# EAGLE schematic DataForge-DAQ (EAGLE 9.2.1)

## Sheet 1 of 8: Block diagram
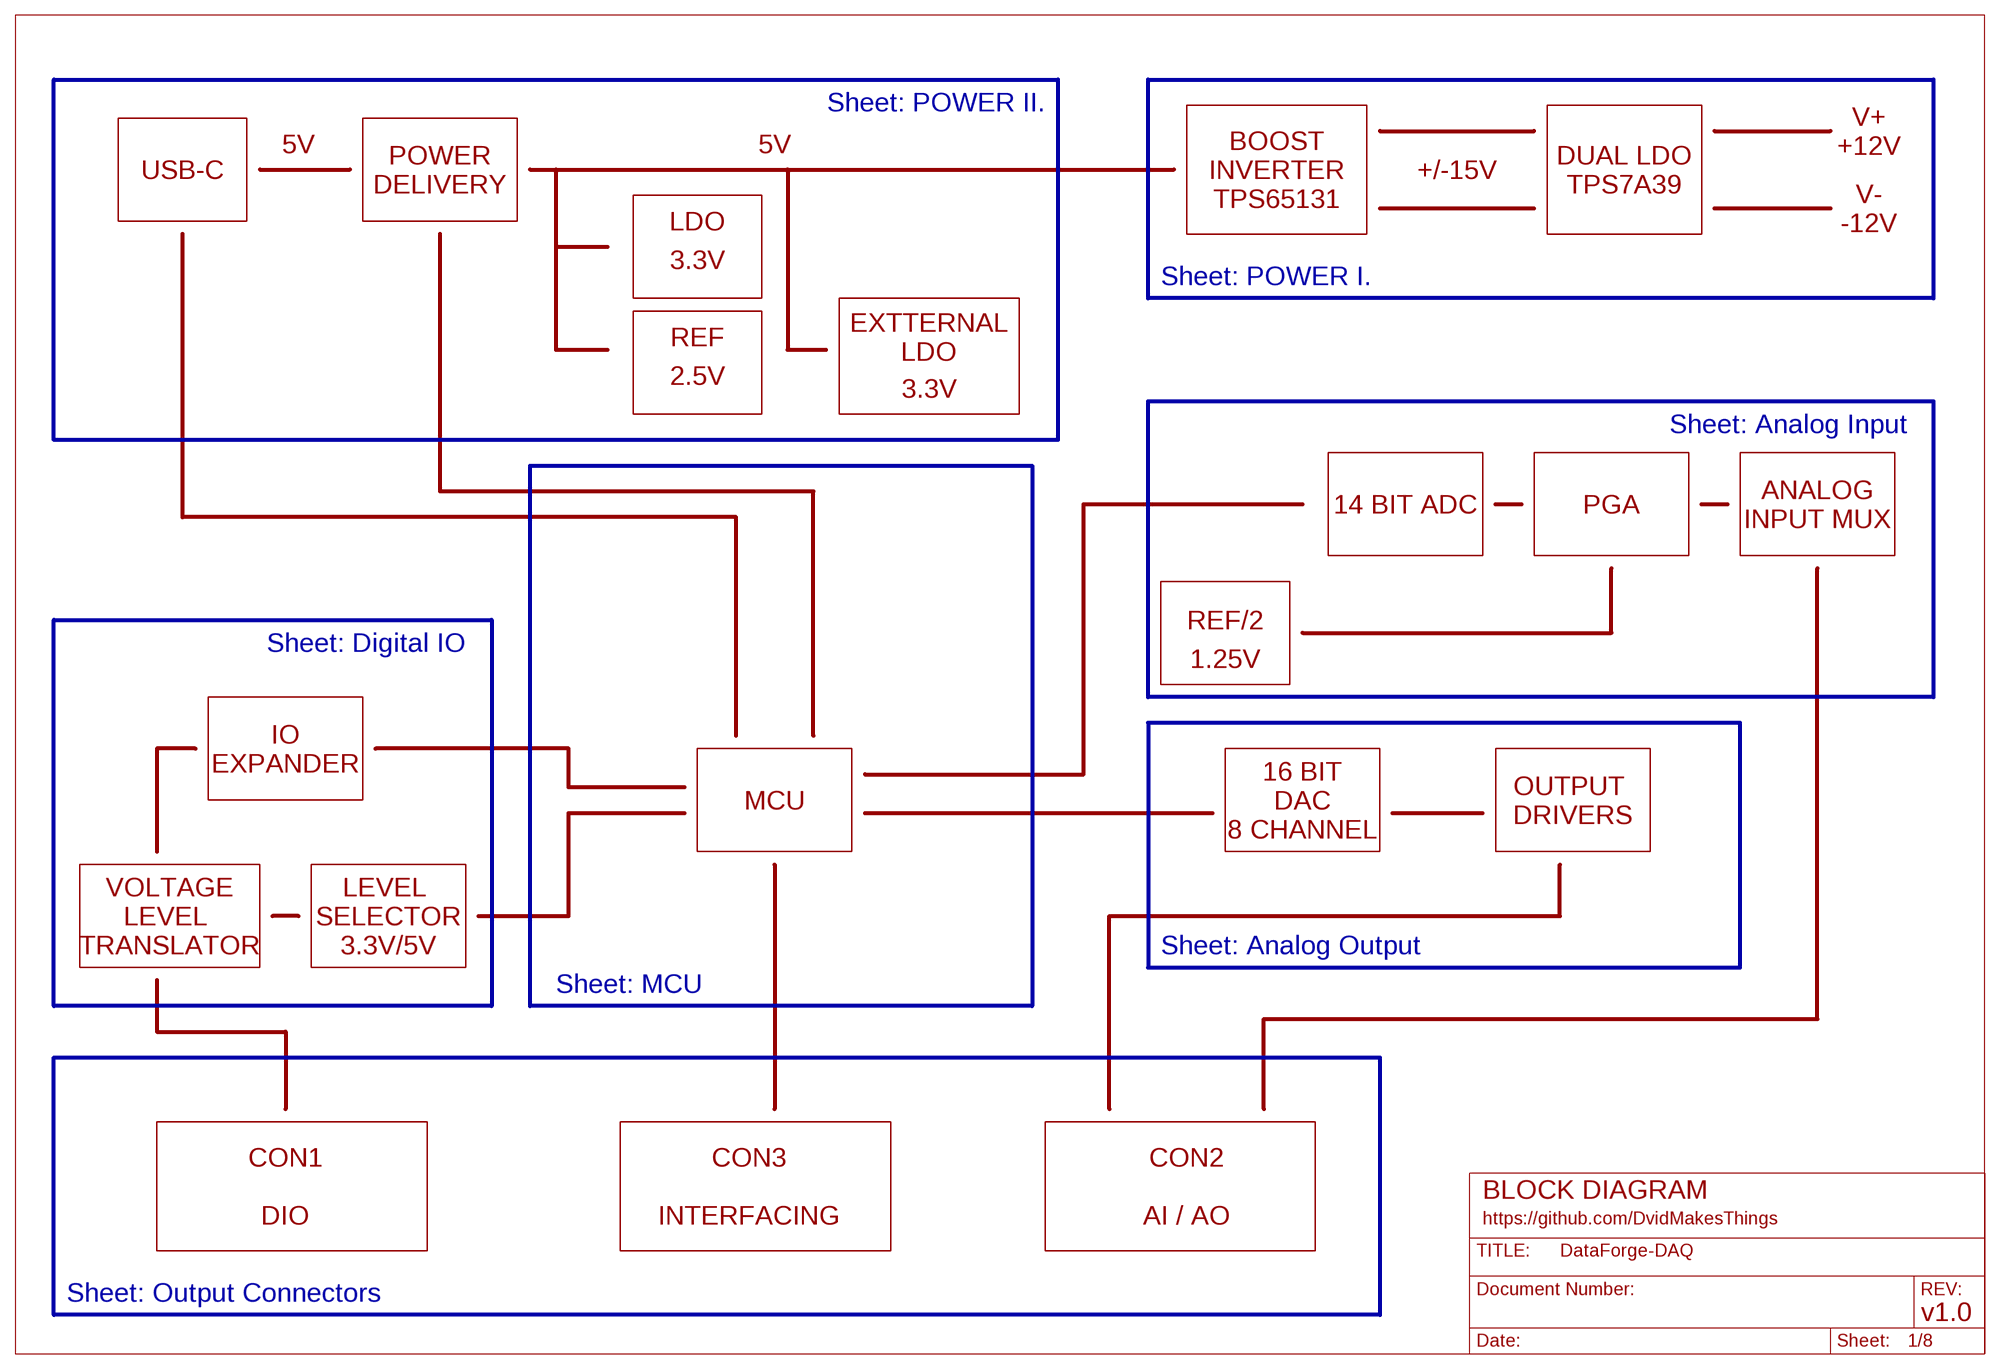
[diagram p0: schematic, sheet 1]

### Buses
B$1
B$2
B$3
B$4
B$5
B$6
B$7

### Notes on the sheet
- Sheet: POWER II.
- V+
  +12V
- 5V | 5V
- USB-C
- POWER
  DELIVERY
- BOOST
  INVERTER
  TPS65131
- +/-15V
- DUAL LDO
  TPS7A39
- V-
  -12V
- LDO
- 3.3V
- Sheet: POWER I.
- REF
- EXTTERNAL
  LDO
- 2.5V
- 3.3V
- Sheet: Analog Input
- 14 BIT ADC | PGA
- ANALOG
  INPUT MUX
- REF/2
- Sheet: Digital IO
- 1.25V
- IO
  EXPANDER
- MCU
- 16 BIT
  DAC
  8 CHANNEL
- OUTPUT 
  DRIVERS
- VOLTAGE
  LEVEL 
  TRANSLATOR
- LEVEL 
  SELECTOR
  3.3V/5V
- Sheet: Analog Output
- Sheet: MCU
- CON1
  
  DIO
- CON3
  
  INTERFACING
- CON2
  
  AI / AO
- BLOCK DIAGRAM
- https://github.com/DvidMakesThings
- Sheet: Output Connectors | v1.0

## Sheet 2 of 8: Power I. +/-12V
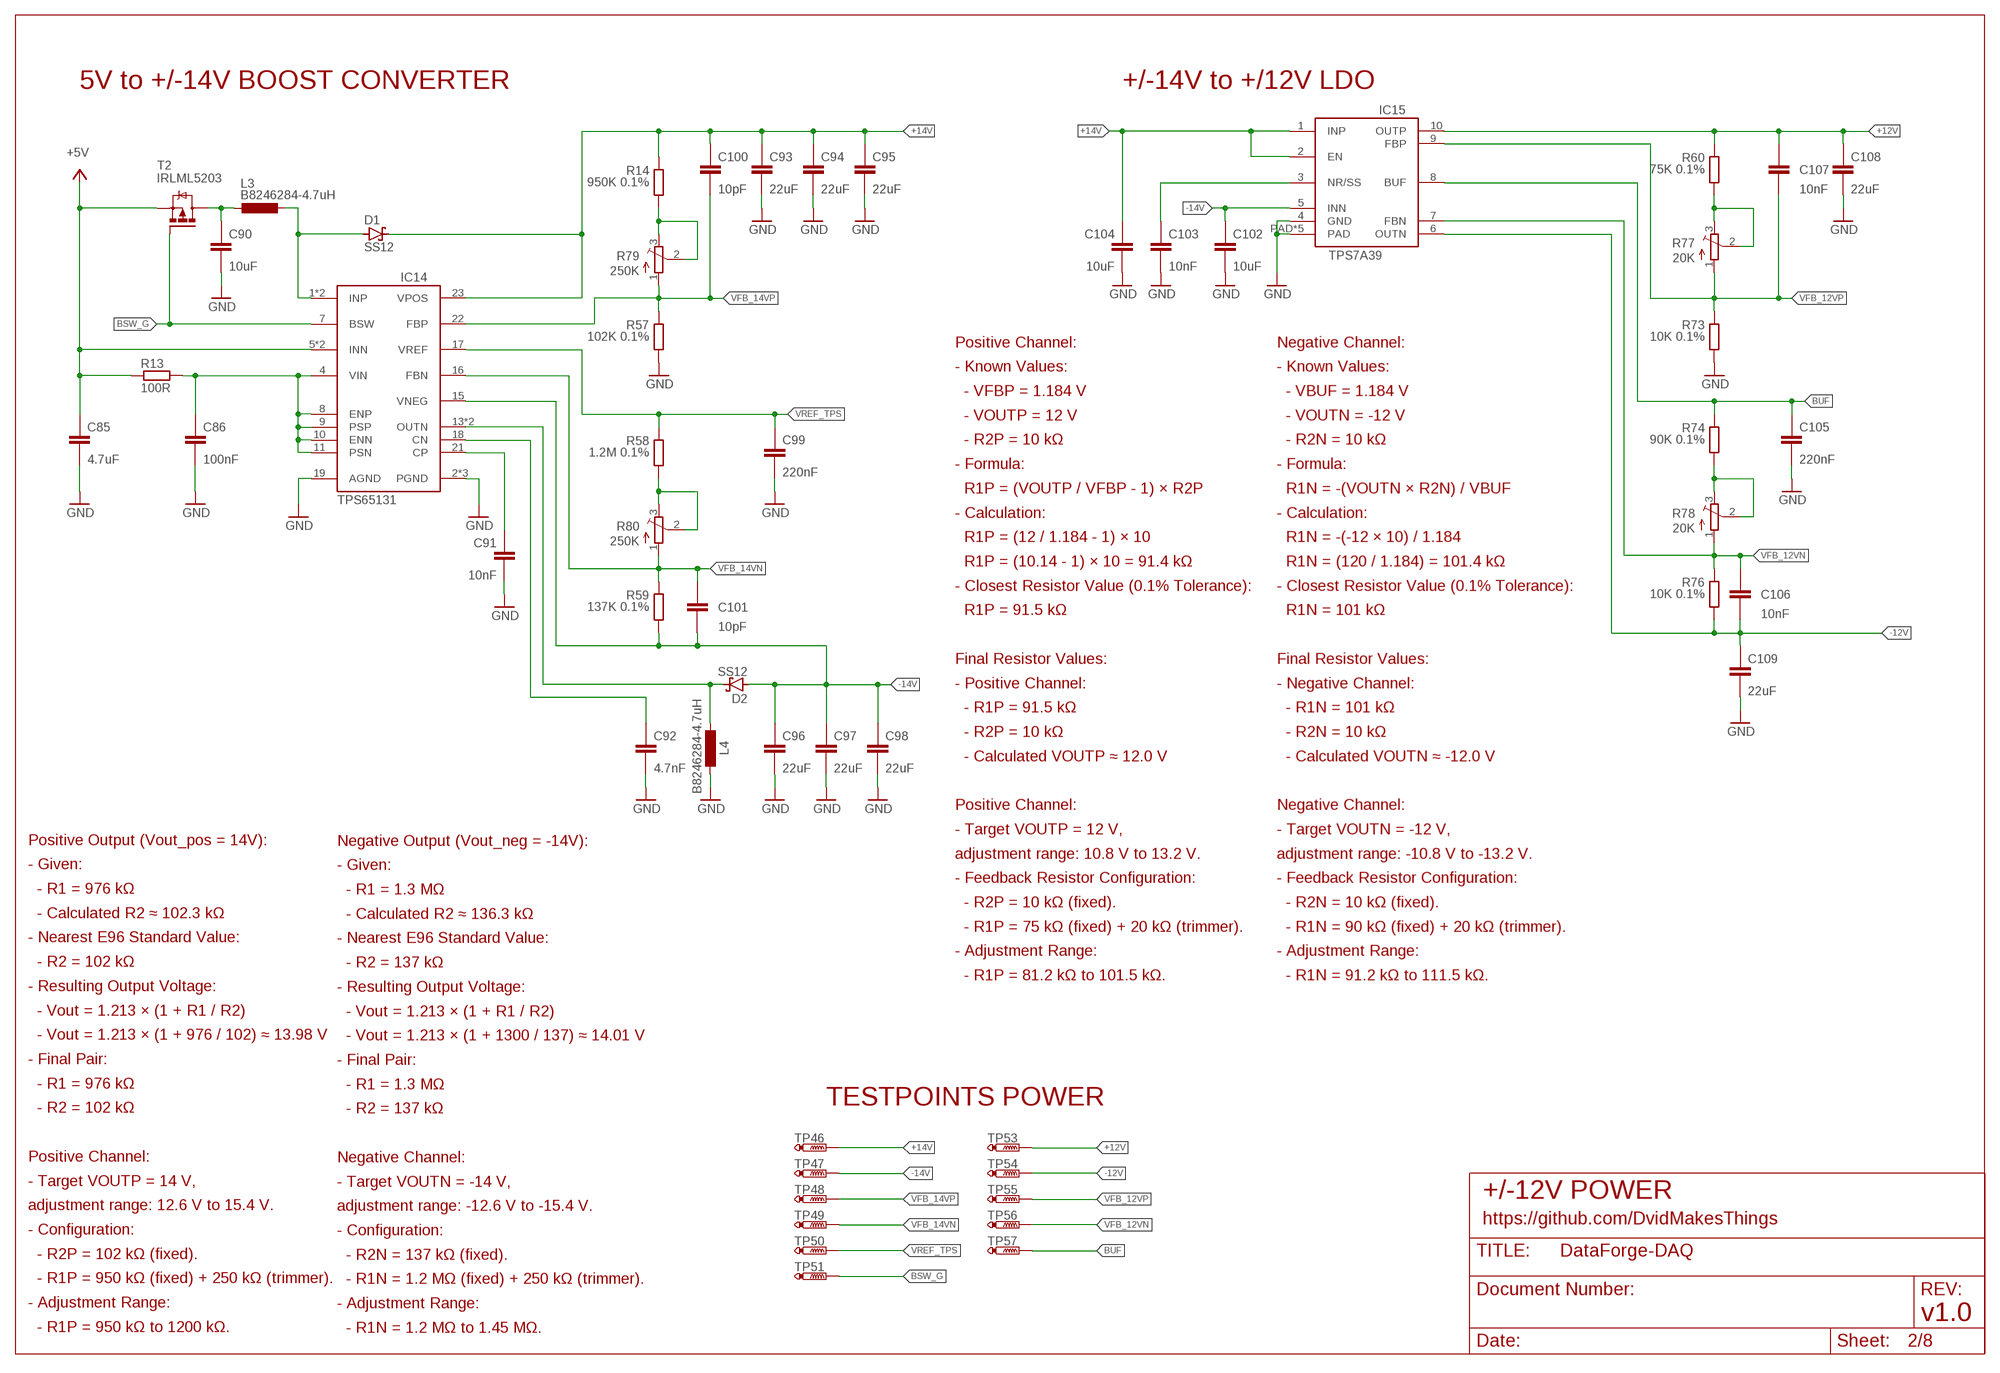
[diagram p1: schematic, sheet 2]

### Parts
C85  4.7uF  C0805  [0805]
C86  100nF  C0805  [0805]
C90  10uF  C0805  [0805]
C91  10nF  C0805  [0805]
C92  4.7nF  C0805  [0805]
C93  22uF  C1206  [1206]
C94  22uF  C1206  [1206]
C95  22uF  C1206  [1206]
C96  22uF  C1206  [1206]
C97  22uF  C1206  [1206]
C98  22uF  C1206  [1206]
C99  220nF  C0402  [0402]
C100  10pF  C0402  [0402]
C101  10pF  C0402  [0402]
C102  10uF  C1206  [1206]
C103  10nF  C1206  [1206]
C104  10uF  C1206  [1206]
C105  220nF  C0402  [0402]
C106  10nF  C0402  [0402]
C107  10nF  C0402  [0402]
C108  22uF  C1206  [1206]
C109  22uF  C1206  [1206]
D1  SS12  [SMA]
D2  SS12  [SMA]
IC14  TPS65131  TPS65131TRGERQ1  [VQFN24-4X4-THERMAL2.5X2.5]
IC15  TPS7A39  TPS7A3901DSCR  [WSON10-3X3]
L3  B8246284-4.7uH  MSS7341  [MSS7341]
L4  B8246284-4.7uH  MSS7341  [MSS7341]
R13  100R  R1206  [1206]
R14  950K 0.1%  R0402  [0402]
R57  102K 0.1%  R0402  [0402]
R58  1.2M 0.1%  R0402  [0402]
R59  137K 0.1%  R0402  [0402]
R60  75K 0.1%  R0402  [0402]
R73  10K 0.1%  R0402  [0402]
R74  90K 0.1%  R0402  [0402]
R76  10K 0.1%  R0402  [0402]
R77  20K  TRIM_EU-3223G  [3223G]
R78  20K  TRIM_EU-3223G  [3223G]
R79  250K  TRIM_EU-3223G  [3223G]
R80  250K  TRIM_EU-3223G  [3223G]
T2  IRLML5203  [MICRO3]
TP46  PTR1B1,27  [B1,27]
TP47  PTR1B1,27  [B1,27]
TP48  PTR1B1,27  [B1,27]
TP49  PTR1B1,27  [B1,27]
TP50  PTR1B1,27  [B1,27]
TP51  PTR1B1,27  [B1,27]
TP53  PTR1B1,27  [B1,27]
TP54  PTR1B1,27  [B1,27]
TP55  PTR1B1,27  [B1,27]
TP56  PTR1B1,27  [B1,27]
TP57  PTR1B1,27  [B1,27]

### Nets
+5V: C85.1 IC14.5(INN) IC14.6(INN) R13.2 T2.2(S) ; also sheet 3,7
+12V: C107.2 C108.1 IC15.10(OUTP) R60.1 TP53.TP
+14V: C93.1 C94.1 C95.1 C100.1 C104.1 D1.C IC14.23(VPOS) IC15.1(INP) IC15.2(EN) R14.1 TP46.TP
-12V: C106.1 C109.1 IC15.6(OUTN) R76.2 TP54.TP
-14V: C96.1 C97.1 C98.1 C101.1 C102.1 D2.A IC14.15(VNEG) IC15.5(INN) R59.2 TP47.TP
BSW_G: IC14.7(BSW) T2.1(G) TP51.TP
BUF: C105.2 IC15.8(BUF) R74.1 TP57.TP
GND: C85.2 C86.2 C90.2 C91.2 C92.2 C93.2 C94.2 C95.2 C96.2 C97.2 C98.2 C99.1 C102.2 C103.2 C104.2 C105.1 C108.2 C109.2 IC14.2(PGND) IC14.3(PGND) IC14.19(AGND) IC14.25(PGND) IC15.4(GND) IC15.PAD IC15.PAD1(PAD) IC15.PAD2(PAD) IC15.PAD3(PAD) IC15.PAD4(PAD) L4.1 R57.2 R73.2 ; also sheet 3,4,5,6,7,8
N$13: D1.A IC14.1(INP) IC14.24(INP) L3.2
N$24: C90.1 L3.1 T2.3(D)
N$30: C86.1 IC14.4(VIN) IC14.8(ENP) IC14.9(PSP) IC14.10(ENN) IC14.11(PSN) R13.1
N$32: C91.1 IC14.21(CP)
N$35: C92.1 IC14.18(CN)
N$36: D2.C IC14.13(OUTN) IC14.14(OUTN) L4.2
N$38: R60.2 R77.2(S) R77.3(E)
N$39: C103.1 IC15.3(NR/SS)
N$42: R74.2 R78.2(S) R78.3(E)
N$43: R14.2 R79.2(S) R79.3(E)
N$44: R58.2 R80.2(S) R80.3(E)
VFB_12VN: C106.2 IC15.7(FBN) R76.1 R78.1(A) TP56.TP
VFB_12VP: C107.1 IC15.9(FBP) R73.1 R77.1(A) TP55.TP
VFB_14VN: C101.2 IC14.16(FBN) R59.1 R80.1(A) TP49.TP
VFB_14VP: C100.2 IC14.22(FBP) R57.1 R79.1(A) TP48.TP
VREF_TPS: C99.2 IC14.17(VREF) R58.1 TP50.TP

### Notes on the sheet
- 5V to +/-14V BOOST CONVERTER | +/-14V to +/12V LDO
- Positive Channel:
  - Known Values:
    - VFBP = 1.184 V
    - VOUTP = 12 V
    - R2P = 10 kΩ
  - Formula:
    R1P = (VOUTP / VFBP - 1) × R2P
  - Calculation:
    R1P = (12 / 1.184 - 1) × 10
    R1P = (10.14 - 1) × 10 = 91.4 kΩ
  - Closest Resistor Value (0.1% Tolerance):
    R1P = 91.5 kΩ
  
  Final Resistor Values:
  - Positive Channel:
    - R1P = 91.5 kΩ
    - R2P = 10 kΩ
    - Calculated VOUTP ≈ 12.0 V
  
  Positive Channel:
  - Target VOUTP = 12 V, 
  adjustment range: 10.8 V to 13.2 V.
  - Feedback Resistor Configuration:
    - R2P = 10 kΩ (fixed).
    - R1P = 75 kΩ (fixed) + 20 kΩ (trimmer).
  - Adjustment Range:
    - R1P = 81.2 kΩ to 101.5 kΩ.
- Negative Channel:
  - Known Values:
    - VBUF = 1.184 V
    - VOUTN = -12 V
    - R2N = 10 kΩ
  - Formula:
    R1N = -(VOUTN × R2N) / VBUF
  - Calculation:
    R1N = -(-12 × 10) / 1.184
    R1N = (120 / 1.184) = 101.4 kΩ
  - Closest Resistor Value (0.1% Tolerance):
    R1N = 101 kΩ
  
  Final Resistor Values:
  - Negative Channel:
    - R1N = 101 kΩ
    - R2N = 10 kΩ
    - Calculated VOUTN ≈ -12.0 V
  
  Negative Channel:
  - Target VOUTN = -12 V, 
  adjustment range: -10.8 V to -13.2 V.
  - Feedback Resistor Configuration:
    - R2N = 10 kΩ (fixed).
    - R1N = 90 kΩ (fixed) + 20 kΩ (trimmer).
  - Adjustment Range:
    - R1N = 91.2 kΩ to 111.5 kΩ.
- Positive Output (Vout_pos = 14V):
  - Given:
    - R1 = 976 kΩ
    - Calculated R2 ≈ 102.3 kΩ
  - Nearest E96 Standard Value:
    - R2 = 102 kΩ
  - Resulting Output Voltage:
    - Vout = 1.213 × (1 + R1 / R2)
    - Vout = 1.213 × (1 + 976 / 102) ≈ 13.98 V
  - Final Pair:
    - R1 = 976 kΩ
    - R2 = 102 kΩ
  
  Positive Channel:
  - Target VOUTP = 14 V, 
  adjustment range: 12.6 V to 15.4 V.
  - Configuration:
    - R2P = 102 kΩ (fixed).
    - R1P = 950 kΩ (fixed) + 250 kΩ (trimmer).
  - Adjustment Range:
    - R1P = 950 kΩ to 1200 kΩ.
- Negative Output (Vout_neg = -14V):
  - Given:
    - R1 = 1.3 MΩ
    - Calculated R2 ≈ 136.3 kΩ
  - Nearest E96 Standard Value:
    - R2 = 137 kΩ
  - Resulting Output Voltage:
    - Vout = 1.213 × (1 + R1 / R2)
    - Vout = 1.213 × (1 + 1300 / 137) ≈ 14.01 V
  - Final Pair:
    - R1 = 1.3 MΩ
    - R2 = 137 kΩ
  
  Negative Channel:
  - Target VOUTN = -14 V, 
  adjustment range: -12.6 V to -15.4 V.
  - Configuration:
    - R2N = 137 kΩ (fixed).
    - R1N = 1.2 MΩ (fixed) + 250 kΩ (trimmer).
  - Adjustment Range:
    - R1N = 1.2 MΩ to 1.45 MΩ.
- TESTPOINTS POWER
- +/-12V POWER
- https://github.com/DvidMakesThings
- v1.0

## Sheet 3 of 8: Power II. USB-C PD
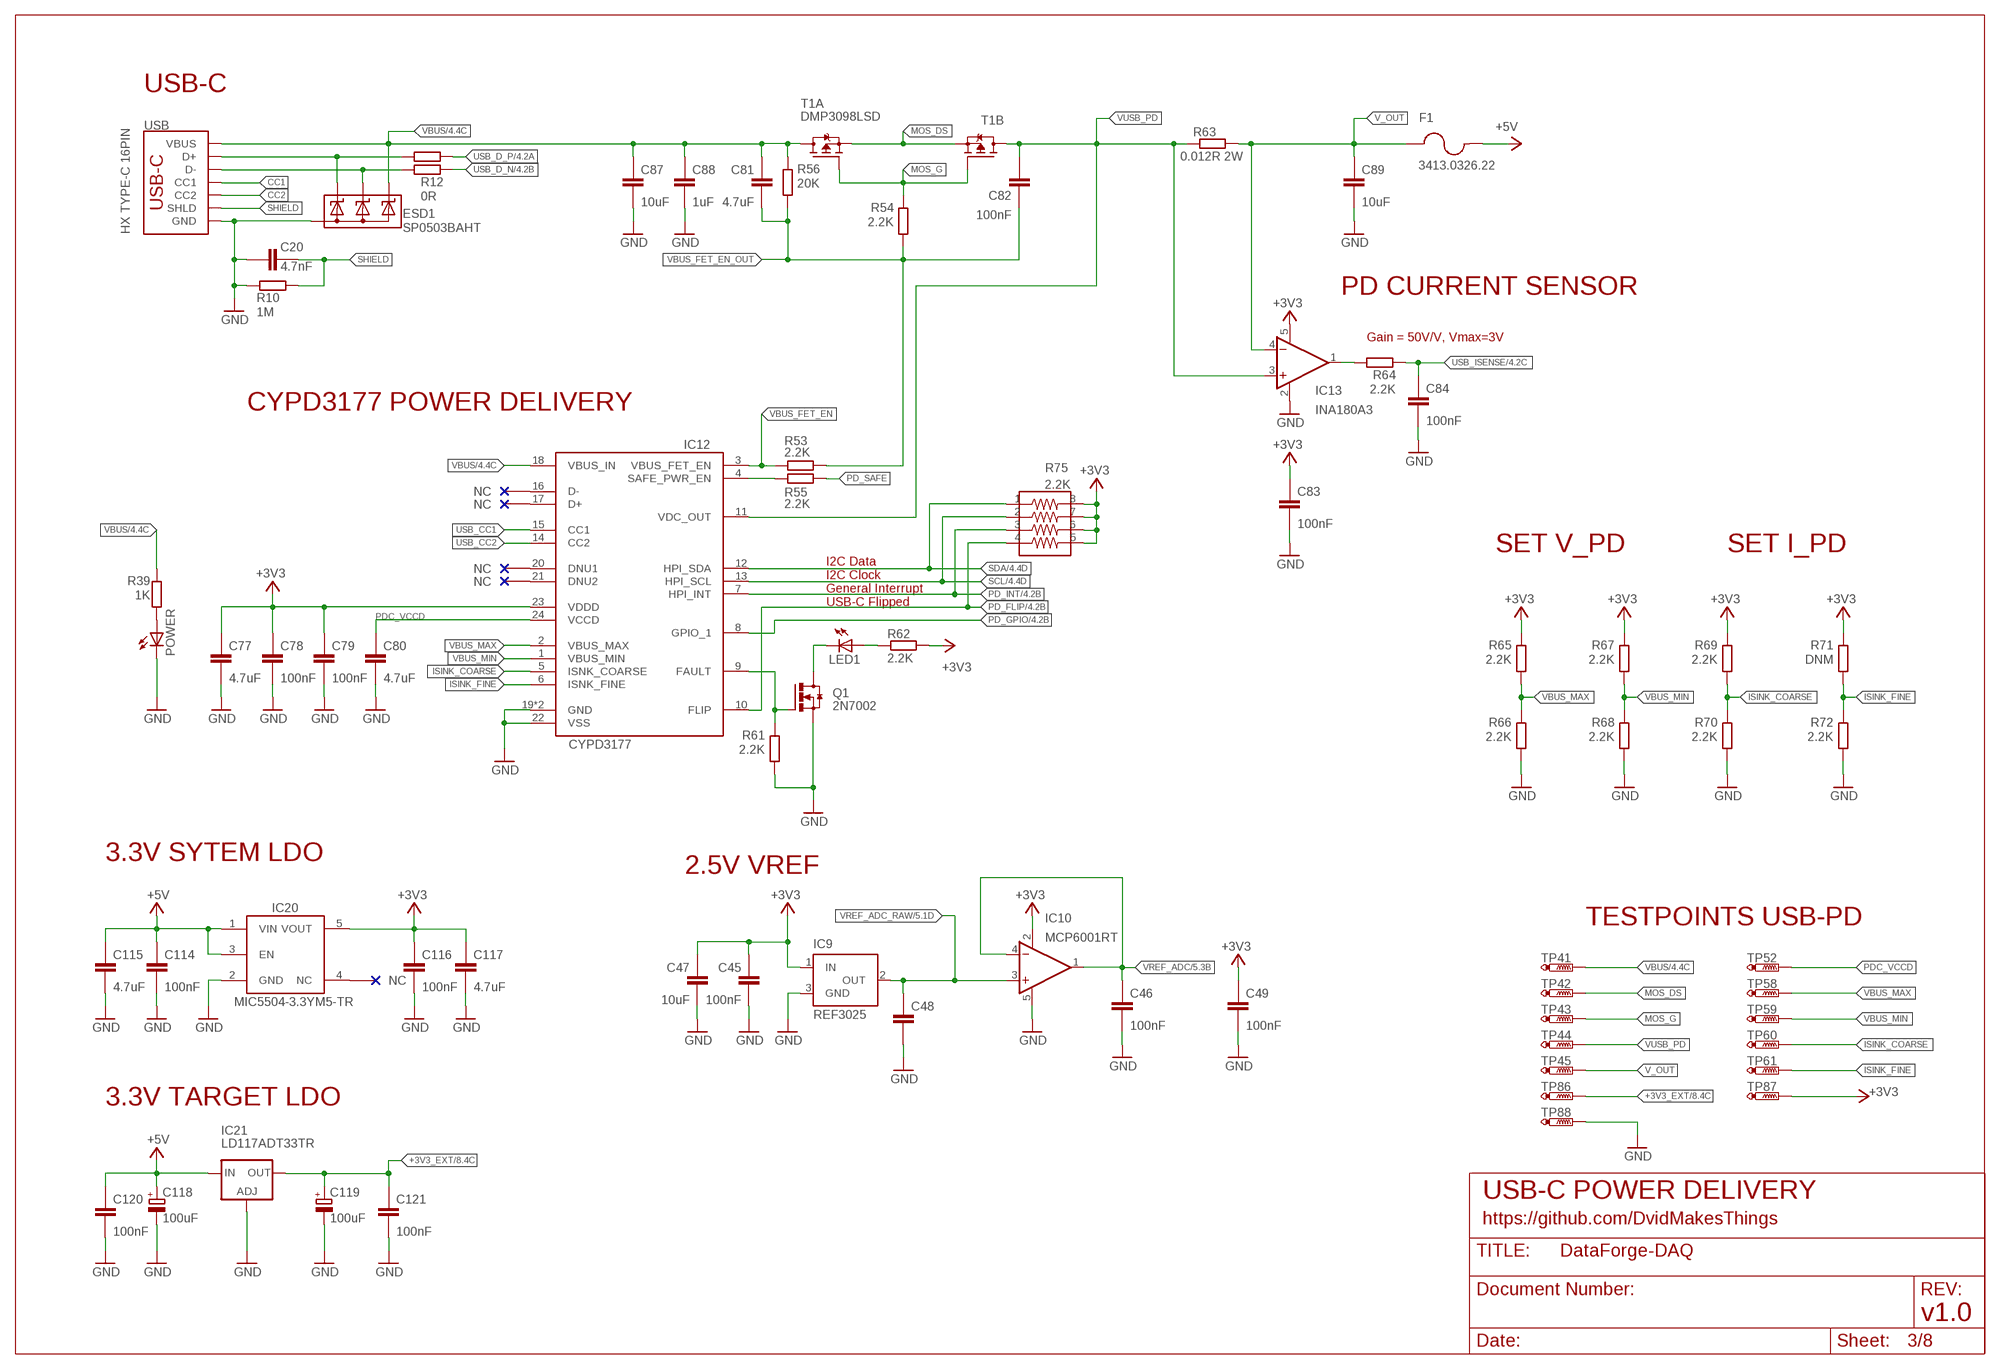
[diagram p2: schematic, sheet 3]

### Parts
C20  4.7nF  C0402  [0402]
C45  100nF  C0402  [0402]
C46  100nF  C0402  [0402]
C47  10uF  C0805  [0805]
C48  C0805  [0805]
C49  100nF  C0402  [0402]
C77  4.7uF  C0603  [0603]
C78  100nF  C0402  [0402]
C79  100nF  C0402  [0402]
C80  4.7uF  C0603  [0603]
C81  4.7uF  C0603  [0603]
C82  100nF  C0402  [0402]
C83  100nF  C0402  [0402]
C84  100nF  C0402  [0402]
C87  10uF  C1206  [1206]
C88  1uF  C1206  [1206]
C89  10uF  C1206  [1206]
C114  100nF  C0402  [0402]
C115  4.7uF  C0603  [0603]
C116  100nF  C0402  [0402]
C117  4.7uF  C0603  [0603]
C118  100uF  CPOL-EU153CLV-0605  [153CLV-0605]
C119  100uF  CPOL-EU153CLV-0605  [153CLV-0605]
C120  100nF  C0402  [0402]
C121  100nF  C0402  [0402]
ESD1  SP0503BAHT  [SOT143]
F1  3413.0326.22  [3413.0326.22]
IC9  REF3025  MAX6520  [SOT23]
IC10  MCP6001RT  [SOT23-5]
IC12  CYPD3177  CYPD3177-24LQXQ  [QFN50P400X400X60-25T275N]
IC13  INA180A3  INA180A3-IDBVR  [SOT23-5]
IC20  MIC5504-3.3YM5-TR  [SOT23-5]
IC21  LD117ADT33TR  [DPACK]
LED1  LEDCHIP-LED0805  [CHIP-LED0805]
POWER  19-213/Y2C-CQ2R2L/3T(CY)  LEDCHIP-LED0603  [CHIP-LED0603]
Q1  2N7002  2N7002,215  [SOT23-3]
R10  1M  R0402  [0402]
R11  0R  R-EU_R0402  [R0402]
R12  0R  R-EU_R0402  [R0402]
R39  1K  R-EU_R0402  [R0402]
R53  2.2K  R0402  [0402]
R54  2.2K  R0402  [0402]
R55  2.2K  R0402  [0402]
R56  20K  R0402  [0402]
R61  2.2K  R0402  [0402]
R62  2.2K  R0402  [0402]
R63  0.012R 2W  R-EU_R2512  [R2512]
R64  2.2K  R0402  [0402]
R65  2.2K  R0402  [0402]
R66  2.2K  R0402  [0402]
R67  2.2K  R0402  [0402]
R68  2.2K  R0402  [0402]
R69  2.2K  R0402  [0402]
R70  2.2K  R0402  [0402]
R71  DNM  R0402  [0402]
R72  2.2K  R0402  [0402]
R75  2.2K  742C083103JP  [742C083103JP]
T1  DMP3098LSD  DMP3098-LSD-13  [SO8]
TP41  PTR1B1,27  [B1,27]
TP42  PTR1B1,27  [B1,27]
TP43  PTR1B1,27  [B1,27]
TP44  PTR1B1,27  [B1,27]
TP45  PTR1B1,27  [B1,27]
TP52  PTR1B1,27  [B1,27]
TP58  PTR1B1,27  [B1,27]
TP59  PTR1B1,27  [B1,27]
TP60  PTR1B1,27  [B1,27]
TP61  PTR1B1,27  [B1,27]
TP86  PTR1B1,27  [B1,27]
TP87  PTR1B1,27  [B1,27]
TP88  PTR1B1,27  [B1,27]
USB  HX TYPE-C 16PIN  USB_C_2-LAYER_PADS  [USB-C-16P-2LAYER-PADS]

### Nets
+3V3: C45.1 C47.1 C49.1 C77.1 C78.1 C79.1 C83.1 C116.1 C117.1 IC9.1(IN) IC10.2(V+) IC12.23(VDDD) IC13.5(V+) IC20.5(VOUT) R62.1 R65.2 R67.2 R69.2 R71.2 R75.5 R75.6 R75.7 R75.8 TP87.TP ; also sheet 4,5,6,7
+3V3_EXT: C119.+ C121.1 IC21.4(OUT) TP86.TP ; also sheet 8
+5V: C114.1 C115.1 C118.+ C120.1 F1.2 IC20.1(VIN) IC20.3(EN) IC21.3(IN) ; also sheet 2,7
CC1: USB.A5(CC1)
CC2: USB.B5(CC2)
D_N1 [DIFFPAIR]: ESD1.3(C2) R12.2 USB.A7(D-) USB.B7(D-)
D_P1 [DIFFPAIR]: ESD1.2(C1) R11.2 USB.A6(D+) USB.B6(D+)
GND: C20.2 C45.2 C46.2 C47.2 C48.2 C49.2 C77.2 C78.2 C79.2 C80.2 C83.2 C84.2 C87.2 C88.2 C89.2 C114.2 C115.2 C116.2 C117.2 C118.- C119.- C120.2 C121.2 ESD1.1(A) IC9.3(GND) IC10.5(V-) IC12.19(GND) IC12.22(VSS) IC12.25(GND) IC13.2(V-) IC20.2(GND) IC21.1(ADJ) POWER.C Q1.2(S) R10.1 R61.1 R66.1 R68.1 R70.1 R72.1 TP88.TP USB.GND USB.GND2(GND) ; also sheet 2,4,5,6,7,8
ISINK_COARSE: IC12.5(ISNK_COARSE) R69.1 R70.2 TP60.TP
ISINK_FINE: IC12.6(ISNK_FINE) R71.1 R72.2 TP61.TP
MOS_DS [DIFFPAIR]: T1.1(A:S) T1.3(B:S) TP42.TP
MOS_G: R54.2 T1.2(A:G) T1.4(B:G) TP43.TP
N$12: IC12.4(SAFE_PWR_EN) R55.1
N$18: IC12.9(FAULT) Q1.1(G) R61.2
N$19: LED1.A R62.2
N$20: LED1.C Q1.3(D)
N$21: IC13.1(OUT) R64.2
N$37: POWER.A R39.2
PD_FLIP: IC12.10(FLIP) R75.4 ; also sheet 4
PD_GPIO: IC12.8(GPIO_1) ; also sheet 4
PD_INT: IC12.7(HPI_INT) R75.3 ; also sheet 4
PD_SAFE: R55.2
PDC_VCCD: C80.1 IC12.24(VCCD) TP52.TP
SCL: IC12.13(HPI_SCL) R75.2 ; also sheet 4
SDA: IC12.12(HPI_SDA) R75.1 ; also sheet 4
SHIELD: C20.1 R10.2 USB.SHLD1(SHLD) USB.SHLD2(SHLD) USB.SHLD3(SHLD) USB.SHLD4(SHLD)
USB_CC1: IC12.15(CC1)
USB_CC2: IC12.14(CC2)
USB_D_N [DIFFPAIR]: R12.1 ; also sheet 4
USB_D_P [DIFFPAIR]: R11.1 ; also sheet 4
USB_ISENSE: C84.1 R64.1 ; also sheet 4
V_OUT [DIFFPAIR]: C89.1 F1.1 IC13.4(-IN) R63.2 TP45.TP
VBUS: C81.1 C87.1 C88.1 ESD1.4(C3) IC12.18(VBUS_IN) R39.1 R56.2 T1.7(A:D) T1.8(A:D) TP41.TP USB.VBUS1(VBUS) USB.VBUS2(VBUS) ; also sheet 4
VBUS_FET_EN: IC12.3(VBUS_FET_EN) R53.1
VBUS_FET_EN_OUT: C81.2 C82.2 R53.2 R54.1 R56.1
VBUS_MAX: IC12.2(VBUS_MAX) R65.1 R66.2 TP58.TP
VBUS_MIN: IC12.1(VBUS_MIN) R67.1 R68.2 TP59.TP
VREF_ADC: C46.1 IC10.1(OUT) IC10.4(-IN) ; also sheet 5
VREF_ADC_RAW: C48.1 IC9.2(OUT) IC10.3(+IN) ; also sheet 5
VUSB_PD [DIFFPAIR]: C82.1 IC12.11(VDC_OUT) IC13.3(+IN) R63.1 T1.5(B:D) T1.6(B:D) TP44.TP
Unconnected: IC12.16(D-) IC12.17(D+) IC12.20(DNU1) IC12.21(DNU2) IC20.4(NC)

### Notes on the sheet
- USB-C
- PD CURRENT SENSOR
- Gain = 50V/V, Vmax=3V
- CYPD3177 POWER DELIVERY
- SET V_PD | SET I_PD
- I2C Data
  I2C Clock
  General Interrupt
  USB-C Flipped
- 3.3V SYTEM LDO
- 2.5V VREF
- TESTPOINTS USB-PD
- 3.3V TARGET LDO
- USB-C POWER DELIVERY
- https://github.com/DvidMakesThings
- v1.0

## Sheet 4 of 8: MCU
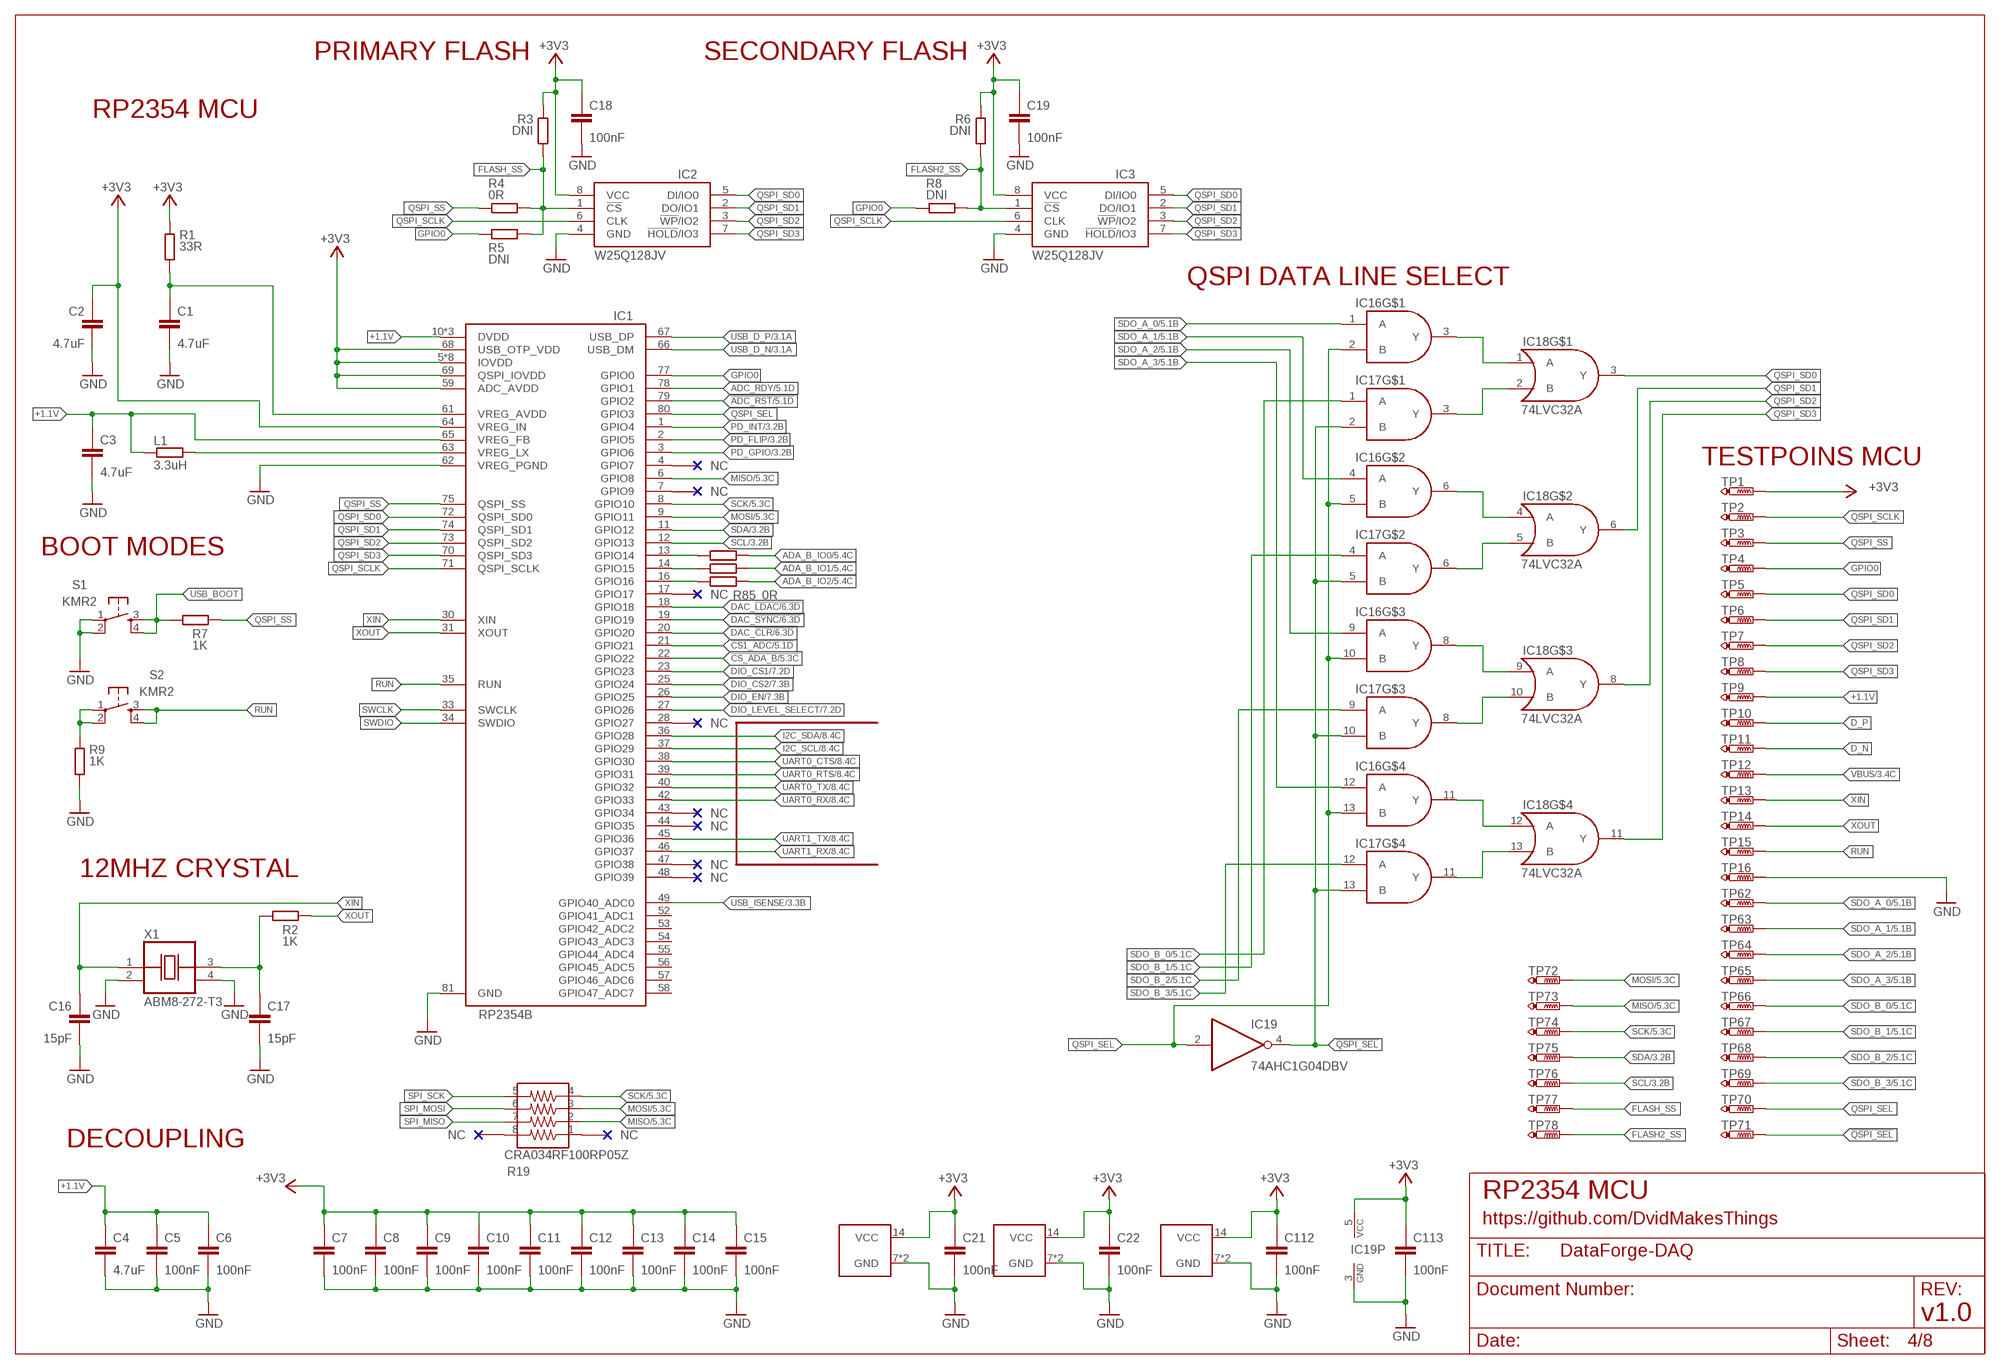
[diagram p3: schematic, sheet 4]

### Parts
C1  4.7uF  C0402  [0402]
C2  4.7uF  C0402  [0402]
C3  4.7uF  C0402  [0402]
C4  4.7uF  C0402  [0402]
C5  100nF  C0402  [0402]
C6  100nF  C0402  [0402]
C7  100nF  C0402  [0402]
C8  100nF  C0402  [0402]
C9  100nF  C0402  [0402]
C10  100nF  C0402  [0402]
C11  100nF  C0402  [0402]
C12  100nF  C0402  [0402]
C13  100nF  C0402  [0402]
C14  100nF  C0402  [0402]
C15  100nF  C0402  [0402]
C16  15pF  C0402  [0402]
C17  15pF  C0402  [0402]
C18  100nF  C0402  [0402]
C19  100nF  C0402  [0402]
C21  100nF  C0402  [0402]
C22  100nF  C0402  [0402]
C112  100nF  C0402  [0402]
C113  100nF  C0402  [0402]
IC1  RP2354B  RP2350BB  [QFN40P1000X1000X85-81T340N]
IC2  W25Q128JVP  [SON127P600X500X75-8N]
IC3  W25Q128JVP  [SON127P600X500X75-8N]
IC16  74LVC08A  [QFN50P250X300X100-15T100X150N]
IC17  74LVC08A  [QFN50P250X300X100-15T100X150N]
IC18  74LVC32A  [QFN50P250X300X100-15T100X150N]
IC19  74AHC1G04DBV  [SOT23-5]
L1  3.3uH  R0805  [0805]
R1  33R  R0402  [0402]
R2  1K  R0402  [0402]
R3  DNI  R0402  [0402]
R4  0R  R0402  [0402]
R5  DNI  R0402  [0402]
R6  DNI  R0402  [0402]
R7  1K  R0402  [0402]
R8  DNI  R0402  [0402]
R9  1K  R0402  [0402]
R19  CRA034RF100RP05Z  YC164-JR-0733RL  [YC164-JR-0733RL]
R83  0R  R0402  [0402]
R84  0R  R0402  [0402]
R85  0R  R0402  [0402]
S1  KMR2  MOMENTARY-SWITCH-SPST-2-SMD-4.6X2.8MM  [TACTILE_SWITCH_SMD_4.6X2.8MM]
S2  KMR2  MOMENTARY-SWITCH-SPST-2-SMD-4.6X2.8MM  [TACTILE_SWITCH_SMD_4.6X2.8MM]
TP1  PTR1B1,27  [B1,27]
TP2  PTR1B1,27  [B1,27]
TP3  PTR1B1,27  [B1,27]
TP4  PTR1B1,27  [B1,27]
TP5  PTR1B1,27  [B1,27]
TP6  PTR1B1,27  [B1,27]
TP7  PTR1B1,27  [B1,27]
TP8  PTR1B1,27  [B1,27]
TP9  PTR1B1,27  [B1,27]
TP10  PTR1B1,27  [B1,27]
TP11  PTR1B1,27  [B1,27]
TP12  PTR1B1,27  [B1,27]
TP13  PTR1B1,27  [B1,27]
TP14  PTR1B1,27  [B1,27]
TP15  PTR1B1,27  [B1,27]
TP16  PTR1B1,27  [B1,27]
TP62  PTR1B1,27  [B1,27]
TP63  PTR1B1,27  [B1,27]
TP64  PTR1B1,27  [B1,27]
TP65  PTR1B1,27  [B1,27]
TP66  PTR1B1,27  [B1,27]
TP67  PTR1B1,27  [B1,27]
TP68  PTR1B1,27  [B1,27]
TP69  PTR1B1,27  [B1,27]
TP70  PTR1B1,27  [B1,27]
TP71  PTR1B1,27  [B1,27]
TP72  PTR1B1,27  [B1,27]
TP73  PTR1B1,27  [B1,27]
TP74  PTR1B1,27  [B1,27]
TP75  PTR1B1,27  [B1,27]
TP76  PTR1B1,27  [B1,27]
TP77  PTR1B1,27  [B1,27]
TP78  PTR1B1,27  [B1,27]
X1  ABM8-272-T3  CRYSTAL  [OSCCC500X320X130]

### Nets
!ADC_RST: IC1.79(GPIO2) ; also sheet 5
!CS1_ADC: IC1.21(GPIO21) ; also sheet 5
!CS_ADA_B: IC1.22(GPIO22) ; also sheet 5
!QSPI_SEL: IC17.2(B) IC17.5(B) IC17.10(B) IC17.13(B) IC19.4(O) TP71.TP
+1.1V: C3.1 C4.1 C5.1 C6.1 IC1.10(DVDD) IC1.32(DVDD) IC1.51(DVDD) IC1.65(VREG_FB) L1.1 TP9.TP
+3V3: C2.1 C7.1 C8.1 C9.1 C10.1 C11.1 C12.1 C13.1 C14.1 C15.1 C21.1 C22.1 C112.1 C113.1 IC1.5(IOVDD) IC1.15(IOVDD) IC1.24(IOVDD) IC1.29(IOVDD) IC1.41(IOVDD) IC1.50(IOVDD) IC1.59(ADC_AVDD) IC1.60(IOVDD) IC1.64(VREG_IN) IC1.68(USB_OTP_VDD) IC1.69(QSPI_IOVDD) IC1.76(IOVDD) IC16.14(VCC) IC17.14(VCC) IC18.14(VCC) IC19.5(VCC) R1.1 TP1.TP ; also sheet 3,5,6,7
ADA_B_IO0: R83.1 ; also sheet 5
ADA_B_IO1: R84.1 ; also sheet 5
ADA_B_IO2: R85.1 ; also sheet 5
ADC_RDY: IC1.78(GPIO1) ; also sheet 5
D_N [DIFFPAIR]: TP11.TP
D_P [DIFFPAIR]: TP10.TP
DAC_!CLR: IC1.20(GPIO20) ; also sheet 6
DAC_!LDAC: IC1.18(GPIO18) ; also sheet 6
DAC_!SYNC: IC1.19(GPIO19) ; also sheet 6
DIO_CS1: IC1.23(GPIO23) ; also sheet 7
DIO_CS2: IC1.25(GPIO24) ; also sheet 7
DIO_EN: IC1.26(GPIO25) ; also sheet 7
DIO_LEVEL_SELECT: IC1.27(GPIO26) ; also sheet 7
FLASH2_SS: IC3.1(!CS) R6.2 R8.2 TP78.TP
FLASH_SS: IC2.1(!CS) R3.2 R4.2 R5.2 TP77.TP
GND: C1.2 C2.2 C3.2 C4.2 C5.2 C6.2 C7.2 C8.2 C9.2 C10.2 C11.2 C12.2 C13.2 C14.2 C15.2 C16.2 C17.2 C18.2 C19.2 C21.2 C22.2 C112.2 C113.2 IC1.62(VREG_PGND) IC1.81(GND) IC2.4(GND) IC3.4(GND) IC16.7(GND) IC16.PAD(GND) IC17.7(GND) IC17.PAD(GND) IC18.7(GND) IC18.PAD(GND) IC19.3(GND) R9.2 S1.1 S1.2 TP16.TP X1.2(VSS) X1.4(VDD) ; also sheet 2,3,5,6,7,8
GPIO0: IC1.77(GPIO0) R5.1 R8.1 TP4.TP
I2C_SCL: IC1.37(GPIO29) ; also sheet 8
I2C_SDA: IC1.36(GPIO28) ; also sheet 8
MISO: IC1.6(GPIO8) R19.2 TP73.TP ; also sheet 5,7
MOSI: IC1.9(GPIO11) R19.3 TP72.TP ; also sheet 5,6,7
N$1: C1.1 IC1.61(VREG_AVDD) R1.2
N$2: IC1.63(VREG_LX) L1.2
N$4: R9.1 S2.1 S2.2
N$8: IC16.3(Y) IC18.1(A)
N$45: IC1.13(GPIO14) R83.2
N$46: IC17.3(Y) IC18.2(B)
N$47: IC16.6(Y) IC18.4(A)
N$48: IC17.6(Y) IC18.5(B)
N$49: IC16.8(Y) IC18.9(A)
N$50: IC1.14(GPIO15) R84.2
N$51: IC17.8(Y) IC18.10(B)
N$52: IC16.11(Y) IC18.12(A)
N$53: IC17.11(Y) IC18.13(B)
N$54: IC1.16(GPIO16) R85.2
PD_FLIP: IC1.2(GPIO5) ; also sheet 3
PD_GPIO: IC1.3(GPIO6) ; also sheet 3
PD_INT: IC1.1(GPIO4) ; also sheet 3
QSPI_SCLK: IC1.71(QSPI_SCLK) IC2.6(CLK) IC3.6(CLK) TP2.TP
QSPI_SD0: IC1.72(QSPI_SD0) IC2.5(DI/IO0) IC3.5(DI/IO0) IC18.3(Y) TP5.TP
QSPI_SD1: IC1.74(QSPI_SD1) IC2.2(DO/IO1) IC3.2(DO/IO1) IC18.6(Y) TP6.TP
QSPI_SD2: IC1.73(QSPI_SD2) IC2.3(!WP!/IO2) IC3.3(!WP!/IO2) IC18.8(Y) TP7.TP
QSPI_SD3: IC1.70(QSPI_SD3) IC2.7(!HOLD!/IO3) IC3.7(!HOLD!/IO3) IC18.11(Y) TP8.TP
QSPI_SEL: IC1.80(GPIO3) IC16.2(B) IC16.5(B) IC16.10(B) IC16.13(B) IC19.2(I) TP70.TP
QSPI_SS: IC1.75(QSPI_SS) R4.1 R7.2 TP3.TP
RUN: IC1.35(RUN) S2.3 S2.4 TP15.TP
SCK: IC1.8(GPIO10) R19.4 TP74.TP ; also sheet 5,6,7
SCL: IC1.12(GPIO13) TP76.TP ; also sheet 3
SDA: IC1.11(GPIO12) TP75.TP ; also sheet 3
SDO_A_0: IC16.1(A) TP62.TP ; also sheet 5
SDO_A_1: IC16.4(A) TP63.TP ; also sheet 5
SDO_A_2: IC16.9(A) TP64.TP ; also sheet 5
SDO_A_3: IC16.12(A) TP65.TP ; also sheet 5
SDO_B_0: IC17.1(A) TP66.TP ; also sheet 5
SDO_B_1: IC17.4(A) TP67.TP ; also sheet 5
SDO_B_2: IC17.9(A) TP68.TP ; also sheet 5
SDO_B_3: IC17.12(A) TP69.TP ; also sheet 5
SPI_MISO: R19.7
SPI_MOSI: R19.6
SPI_SCK: R19.5
SWCLK: IC1.33(SWCLK)
SWDIO: IC1.34(SWDIO)
UART0_CTS: IC1.38(GPIO30) ; also sheet 8
UART0_RTS: IC1.39(GPIO31) ; also sheet 8
UART0_RX: IC1.42(GPIO33) ; also sheet 8
UART0_TX: IC1.40(GPIO32) ; also sheet 8
UART1_RX: IC1.46(GPIO37) ; also sheet 8
UART1_TX: IC1.45(GPIO36) ; also sheet 8
USB_BOOT: R7.1 S1.3 S1.4
USB_D_N [DIFFPAIR]: IC1.66(USB_DM) ; also sheet 3
USB_D_P [DIFFPAIR]: IC1.67(USB_DP) ; also sheet 3
USB_ISENSE: IC1.49(GPIO40_ADC0) ; also sheet 3
VBUS: TP12.TP ; also sheet 3
VCC: C18.1 C19.1 IC2.8(VCC) IC3.8(VCC) R3.1 R6.1 ; supply symbol labelled +3V3
XIN: C16.1 IC1.30(XIN) TP13.TP X1.1(CON)
XOUT: IC1.31(XOUT) R2.2 TP14.TP
XOUTC: C17.1 R2.1 X1.3(OUT)
Unconnected: IC1.4(GPIO7) IC1.7(GPIO9) IC1.17(GPIO17) IC1.28(GPIO27) IC1.43(GPIO34) IC1.44(GPIO35) IC1.47(GPIO38) IC1.48(GPIO39) IC1.52(GPIO41_ADC1) IC1.53(GPIO42_ADC2) IC1.54(GPIO43_ADC3) IC1.55(GPIO44_ADC4) IC1.56(GPIO45_ADC5) IC1.57(GPIO46_ADC6) IC1.58(GPIO47_ADC7) R19.1 R19.8

### Notes on the sheet
- PRIMARY FLASH | SECONDARY FLASH
- RP2354 MCU
- QSPI DATA LINE SELECT
- TESTPOINS MCU
- BOOT MODES
- 12MHZ CRYSTAL
- DECOUPLING
- RP2354 MCU
- https://github.com/DvidMakesThings
- v1.0

## Sheet 5 of 8: Analog Input
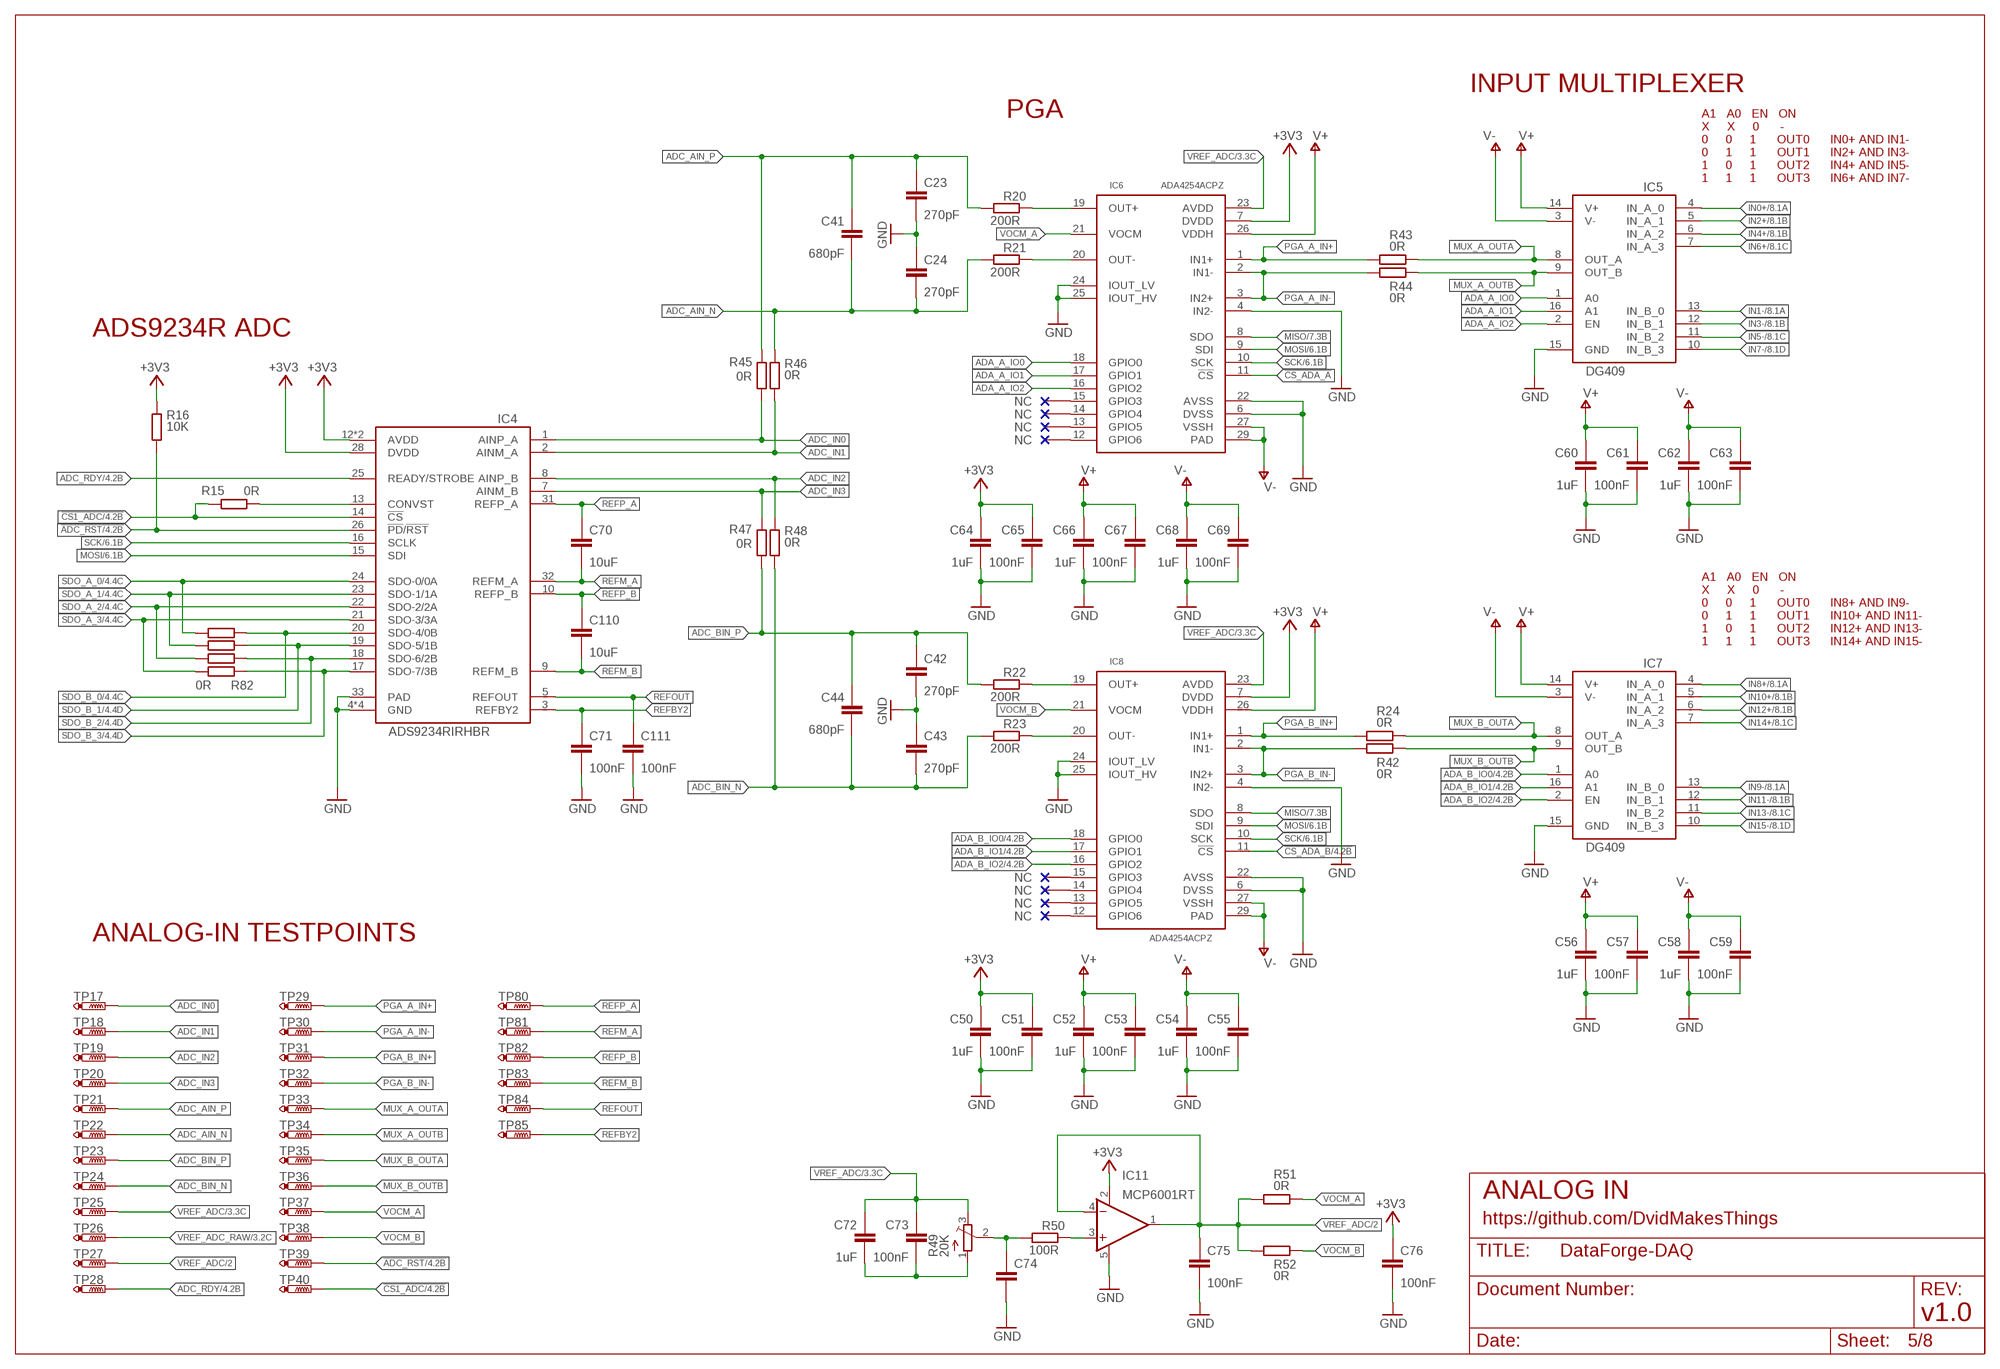
[diagram p4: schematic, sheet 5]

### Parts
C23  270pF  C0402  [0402]
C24  270pF  C0402  [0402]
C41  680pF  C0402  [0402]
C42  270pF  C0402  [0402]
C43  270pF  C0402  [0402]
C44  680pF  C0402  [0402]
C50  1uF  C0603  [0603]
C51  100nF  C0603  [0603]
C52  1uF  C0603  [0603]
C53  100nF  C0603  [0603]
C54  1uF  C0603  [0603]
C55  100nF  C0603  [0603]
C56  1uF  C0603  [0603]
C57  100nF  C0603  [0603]
C58  1uF  C0603  [0603]
C59  100nF  C0603  [0603]
C60  1uF  C0603  [0603]
C61  100nF  C0603  [0603]
C62  1uF  C0603  [0603]
C63  100nF  C0603  [0603]
C64  1uF  C0603  [0603]
C65  100nF  C0603  [0603]
C66  1uF  C0603  [0603]
C67  100nF  C0603  [0603]
C68  1uF  C0603  [0603]
C69  100nF  C0603  [0603]
C70  10uF  C0805  [0805]
C71  100nF  C0603  [0603]
C72  1uF  C0603  [0603]
C73  100nF  C0603  [0603]
C74  C0805  [0805]
C75  100nF  C0402  [0402]
C76  100nF  C0402  [0402]
C110  10uF  C0805  [0805]
C111  100nF  C0603  [0603]
IC4  ADS9234RIRHBR  [VQFN32-5X5]
IC5  DG409  [TSSOP16]
IC6  ADA4254ACPZ  [QFN50P500X500X75-29T314N]
IC7  DG409  [TSSOP16]
IC8  ADA4254ACPZ  [QFN50P500X500X75-29T314N]
IC11  MCP6001RT  [SOT23-5]
R15  0R  R0402  [0402]
R16  10K  R0402  [0402]
R17  0R  R0402  [0402]
R18  0R  R0402  [0402]
R20  200R  R0402  [0402]
R21  200R  R0402  [0402]
R22  200R  R0402  [0402]
R23  200R  R0402  [0402]
R24  0R  R0603  [0603]
R42  0R  R0603  [0603]
R43  0R  R0603  [0603]
R44  0R  R0603  [0603]
R45  0R  R0603  [0603]
R46  0R  R0603  [0603]
R47  0R  R0603  [0603]
R48  0R  R0603  [0603]
R49  20K  TRIM_EU-3223G  [3223G]
R50  100R  R0402  [0402]
R51  0R  R0603  [0603]
R52  0R  R0603  [0603]
R81  0R  R0402  [0402]
R82  0R  R0402  [0402]
TP17  PTR1B1,27  [B1,27]
TP18  PTR1B1,27  [B1,27]
TP19  PTR1B1,27  [B1,27]
TP20  PTR1B1,27  [B1,27]
TP21  PTR1B1,27  [B1,27]
TP22  PTR1B1,27  [B1,27]
TP23  PTR1B1,27  [B1,27]
TP24  PTR1B1,27  [B1,27]
TP25  PTR1B1,27  [B1,27]
TP26  PTR1B1,27  [B1,27]
TP27  PTR1B1,27  [B1,27]
TP28  PTR1B1,27  [B1,27]
TP29  PTR1B1,27  [B1,27]
TP30  PTR1B1,27  [B1,27]
TP31  PTR1B1,27  [B1,27]
TP32  PTR1B1,27  [B1,27]
TP33  PTR1B1,27  [B1,27]
TP34  PTR1B1,27  [B1,27]
TP35  PTR1B1,27  [B1,27]
TP36  PTR1B1,27  [B1,27]
TP37  PTR1B1,27  [B1,27]
TP38  PTR1B1,27  [B1,27]
TP39  PTR1B1,27  [B1,27]
TP40  PTR1B1,27  [B1,27]
TP80  PTR1B1,27  [B1,27]
TP81  PTR1B1,27  [B1,27]
TP82  PTR1B1,27  [B1,27]
TP83  PTR1B1,27  [B1,27]
TP84  PTR1B1,27  [B1,27]
TP85  PTR1B1,27  [B1,27]

### Nets
!ADC_RST: IC4.26(!PD!/!RST) R16.2 TP39.TP ; also sheet 4
!CS1_ADC: IC4.14(!CS) R15.1 TP40.TP ; also sheet 4
!CS_ADA_A: IC6.11(!CS)
!CS_ADA_B: IC8.11(!CS) ; also sheet 4
+3V3: C50.1 C51.1 C64.1 C65.1 C76.1 IC4.12(AVDD) IC4.28(DVDD) IC4.29(AVDD) IC6.7(DVDD) IC8.7(DVDD) IC11.2(V+) R16.1 ; also sheet 3,4,6,7
ADA_A_IO0: IC5.1(A0) IC6.18(GPIO0)
ADA_A_IO1: IC5.16(A1) IC6.17(GPIO1)
ADA_A_IO2: IC5.2(EN) IC6.16(GPIO2)
ADA_B_IO0: IC7.1(A0) IC8.18(GPIO0) ; also sheet 4
ADA_B_IO1: IC7.16(A1) IC8.17(GPIO1) ; also sheet 4
ADA_B_IO2: IC7.2(EN) IC8.16(GPIO2) ; also sheet 4
ADC_AIN_N: C24.2 C41.2 R21.1 R46.1 TP22.TP
ADC_AIN_P: C23.1 C41.1 R20.1 R45.2 TP21.TP
ADC_BIN_N: C43.2 C44.2 R23.1 R48.2 TP24.TP
ADC_BIN_P: C42.1 C44.1 R22.1 R47.1 TP23.TP
ADC_IN0: IC4.1(AINP_A) R45.1 TP17.TP
ADC_IN1: IC4.2(AINM_A) R46.2 TP18.TP
ADC_IN2: IC4.8(AINP_B) R48.1 TP19.TP
ADC_IN3: IC4.7(AINM_B) R47.2 TP20.TP
ADC_RDY: IC4.25(READY/STROBE) TP28.TP ; also sheet 4
GND: C23.2 C24.1 C42.2 C43.1 C50.2 C51.2 C52.2 C53.2 C54.2 C55.2 C56.2 C57.2 C58.2 C59.2 C60.2 C61.2 C62.2 C63.2 C64.2 C65.2 C66.2 C67.2 C68.2 C69.2 C71.2 C74.2 C75.2 C76.2 C111.2 IC4.4(GND) IC4.11(GND) IC4.27(GND) IC4.30(GND) IC4.33(PAD) IC5.15(GND) IC6.4(IN2-) IC6.6(DVSS) IC6.22(AVSS) IC6.24(IOUT_LV) IC6.25(IOUT_HV) IC7.15(GND) IC8.4(IN2-) IC8.6(DVSS) IC8.22(AVSS) IC8.24(IOUT_LV) IC8.25(IOUT_HV) IC11.5(V-) ; also sheet 2,3,4,6,7,8
IN0+: IC5.4(IN_A_0) ; also sheet 8
IN1-: IC5.13(IN_B_0) ; also sheet 8
IN2+: IC5.5(IN_A_1) ; also sheet 8
IN3-: IC5.12(IN_B_1) ; also sheet 8
IN4+: IC5.6(IN_A_2) ; also sheet 8
IN5-: IC5.11(IN_B_2) ; also sheet 8
IN6+: IC5.7(IN_A_3) ; also sheet 8
IN7-: IC5.10(IN_B_3) ; also sheet 8
IN8+: IC7.4(IN_A_0) ; also sheet 8
IN9-: IC7.13(IN_B_0) ; also sheet 8
IN10+: IC7.5(IN_A_1) ; also sheet 8
IN11-: IC7.12(IN_B_1) ; also sheet 8
IN12+: IC7.6(IN_A_2) ; also sheet 8
IN13-: IC7.11(IN_B_2) ; also sheet 8
IN14+: IC7.7(IN_A_3) ; also sheet 8
IN15-: IC7.10(IN_B_3) ; also sheet 8
MISO: IC6.8(SDO) IC8.8(SDO) ; also sheet 4,7
MOSI: IC4.15(SDI) IC6.9(SDI) IC8.9(SDI) ; also sheet 4,6,7
MUX_A_OUTA: IC5.8(OUT_A) R43.2 TP33.TP
MUX_A_OUTB: IC5.9(OUT_B) R44.1 TP34.TP
MUX_B_OUTA: IC7.8(OUT_A) R24.2 TP35.TP
MUX_B_OUTB: IC7.9(OUT_B) R42.1 TP36.TP
N$5: IC4.13(CONVST) R15.2
N$6: C74.1 R49.2(S) R50.1
N$7: C72.2 C73.2 R49.1(A)
N$9: IC6.19(OUT+) R20.2
N$10: IC6.20(OUT-) R21.2
N$11: IC11.3(+IN) R50.2
N$15: IC8.19(OUT+) R22.2
N$16: IC8.20(OUT-) R23.2
PGA_A_IN+: IC6.1(IN1+) R43.1 TP29.TP
PGA_A_IN-: IC6.2(IN1-) IC6.3(IN2+) R44.2 TP30.TP
PGA_B_IN+: IC8.1(IN1+) R24.1 TP31.TP
PGA_B_IN-: IC8.2(IN1-) IC8.3(IN2+) R42.2 TP32.TP
REFBY2: C71.1 IC4.3(REFBY2) TP85.TP
REFM_A: C70.2 IC4.32(REFM_A) TP81.TP
REFM_B: C110.2 IC4.9(REFM_B) TP83.TP
REFOUT: C111.1 IC4.5(REFOUT) TP84.TP
REFP_A: C70.1 IC4.31(REFP_A) TP80.TP
REFP_B: C110.1 IC4.10(REFP_B) TP82.TP
SCK: IC4.16(SCLK) IC6.10(SCK) IC8.10(SCK) ; also sheet 4,6,7
SDO_A_0: IC4.24(SDO-0/0A) R17.2 ; also sheet 4
SDO_A_1: IC4.23(SDO-1/1A) R18.2 ; also sheet 4
SDO_A_2: IC4.22(SDO-2/2A) R81.2 ; also sheet 4
SDO_A_3: IC4.21(SDO-3/3A) R82.2 ; also sheet 4
SDO_B_0: IC4.20(SDO-4/0B) R17.1 ; also sheet 4
SDO_B_1: IC4.19(SDO-5/1B) R18.1 ; also sheet 4
SDO_B_2: IC4.18(SDO-6/2B) R81.1 ; also sheet 4
SDO_B_3: IC4.17(SDO-7/3B) R82.1 ; also sheet 4
V+: C52.1 C53.1 C56.1 C57.1 C60.1 C61.1 C66.1 C67.1 IC5.14(V+) IC6.26(VDDH) IC7.14(V+) IC8.26(VDDH)
V-: C54.1 C55.1 C58.1 C59.1 C62.1 C63.1 C68.1 C69.1 IC5.3(V-) IC6.27(VSSH) IC6.29(PAD) IC7.3(V-) IC8.27(VSSH) IC8.29(PAD)
VOCM_A: IC6.21(VOCM) R51.2 TP37.TP
VOCM_B: IC8.21(VOCM) R52.1 TP38.TP
VREF_ADC: C72.1 C73.1 IC6.23(AVDD) IC8.23(AVDD) R49.3(E) TP25.TP ; also sheet 3
VREF_ADC/2: C75.1 IC11.1(OUT) IC11.4(-IN) R51.1 R52.2 TP27.TP
VREF_ADC_RAW: TP26.TP ; also sheet 3
Unconnected: IC6.12(GPIO6) IC6.13(GPIO5) IC6.14(GPIO4) IC6.15(GPIO3) IC8.12(GPIO6) IC8.13(GPIO5) IC8.14(GPIO4) IC8.15(GPIO3)

### Notes on the sheet
- INPUT MULTIPLEXER
- PGA | A1   A0   EN   ON
- X     X     0      -
- 0     0     1      OUT0 | IN0+ AND IN1-
- 0     1     1      OUT1 | IN2+ AND IN3-
- 1     0     1      OUT2 | IN4+ AND IN5-
- 1     1     1      OUT3 | IN6+ AND IN7-
- ADS9234R ADC
- A1   A0   EN   ON
- X     X     0      -
- 0     0     1      OUT0 | IN8+ AND IN9-
- 0     1     1      OUT1 | IN10+ AND IN11-
- 1     0     1      OUT2 | IN12+ AND IN13-
- 1     1     1      OUT3 | IN14+ AND IN15-
- ANALOG-IN TESTPOINTS
- ANALOG IN
- https://github.com/DvidMakesThings
- v1.0

## Sheet 6 of 8: Analog Output
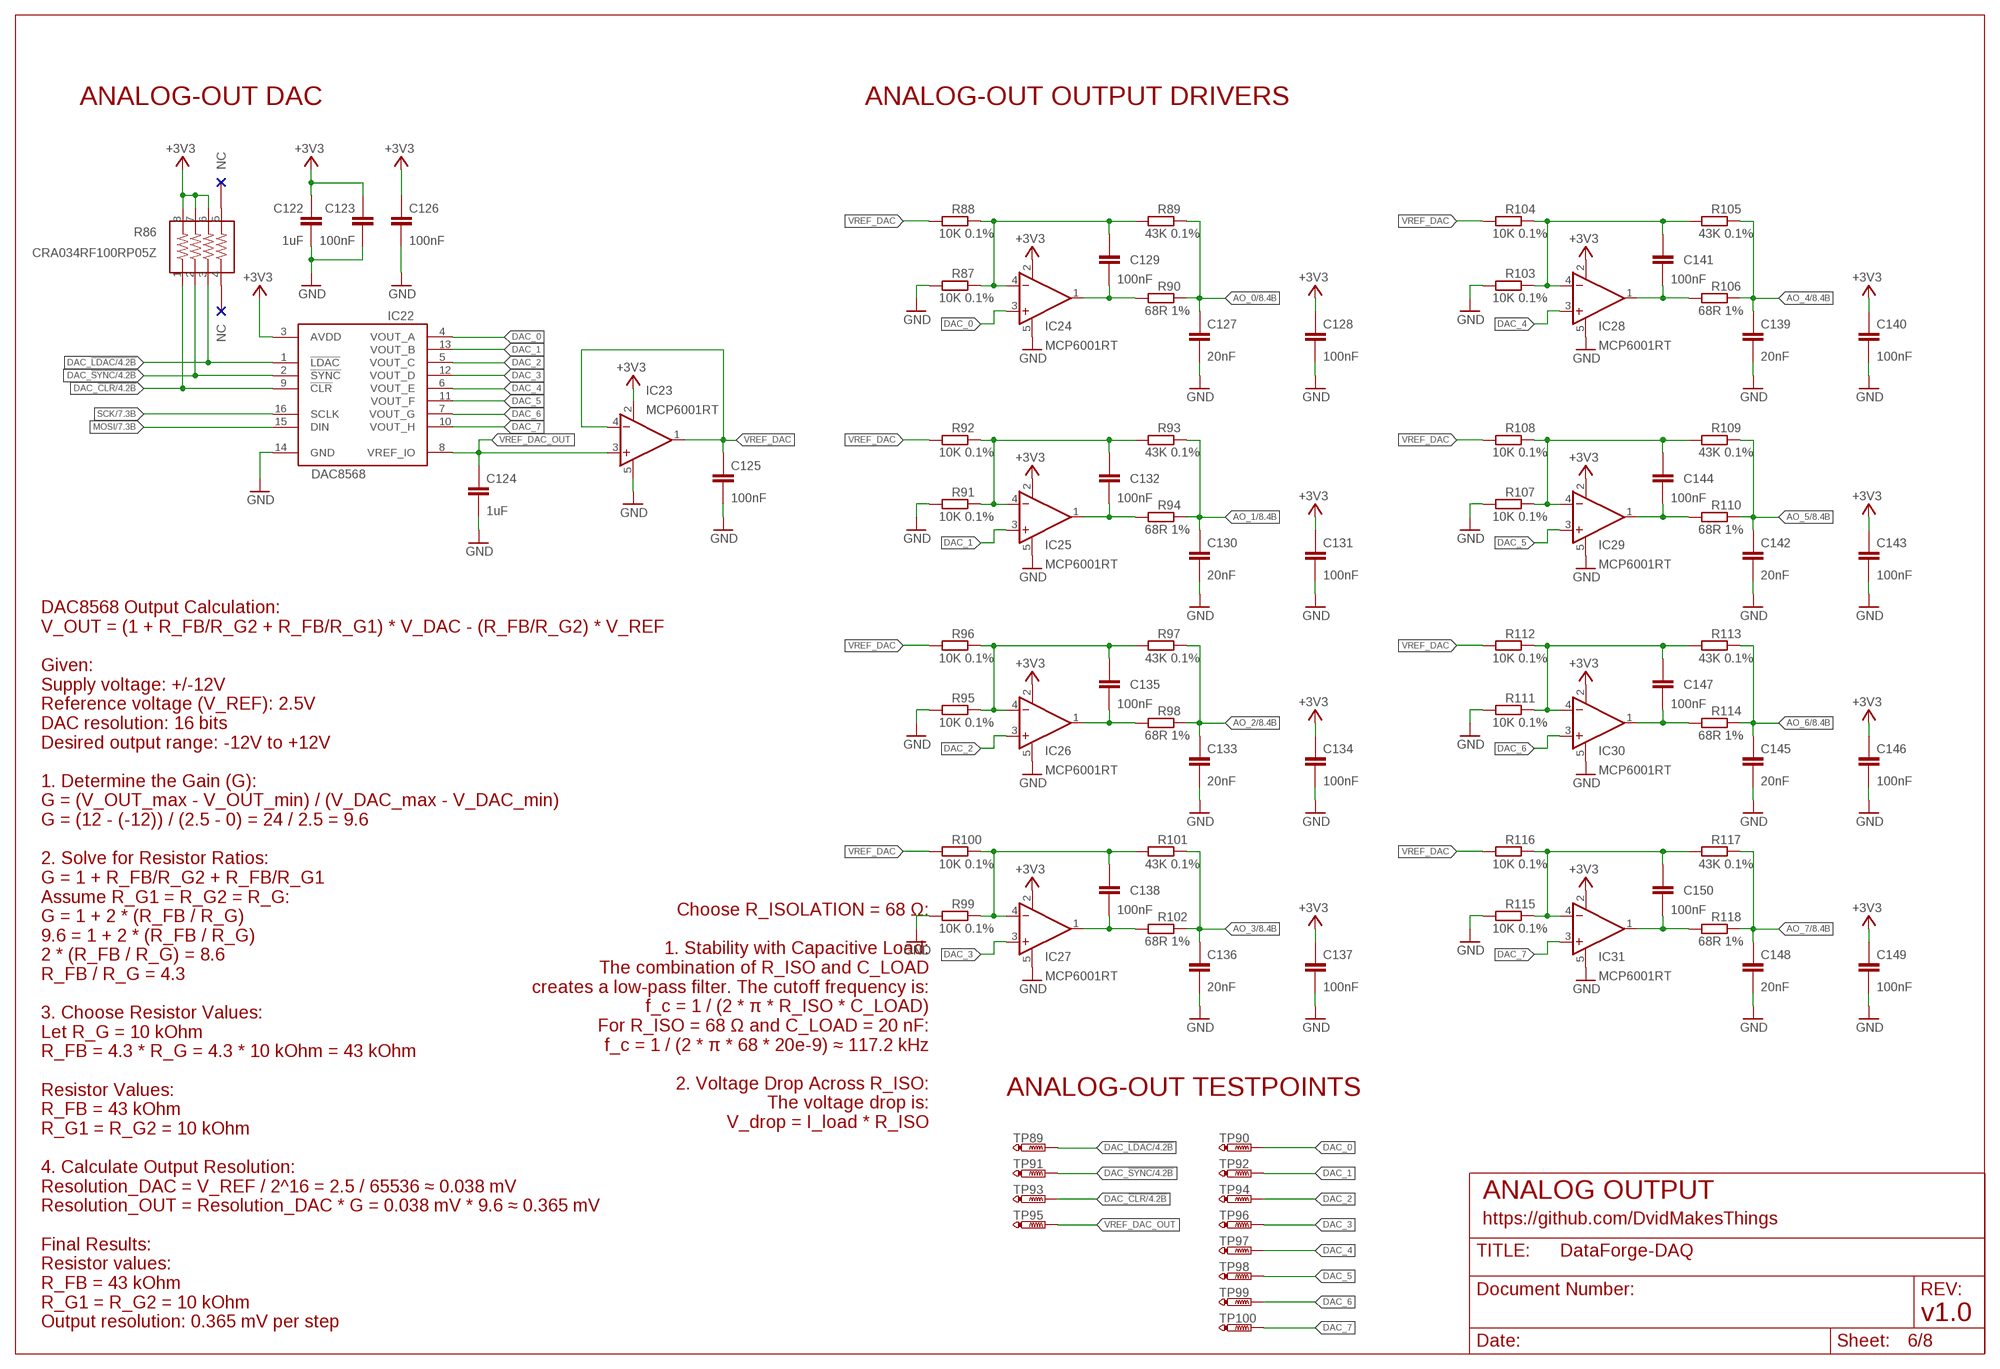
[diagram p5: schematic, sheet 6]

### Parts
C122  1uF  C0603  [0603]
C123  100nF  C0603  [0603]
C124  1uF  C0603  [0603]
C125  100nF  C0402  [0402]
C126  100nF  C0402  [0402]
C127  20nF  C0402  [0402]
C128  100nF  C0402  [0402]
C129  100nF  C0402  [0402]
C130  20nF  C0402  [0402]
C131  100nF  C0402  [0402]
C132  100nF  C0402  [0402]
C133  20nF  C0402  [0402]
C134  100nF  C0402  [0402]
C135  100nF  C0402  [0402]
C136  20nF  C0402  [0402]
C137  100nF  C0402  [0402]
C138  100nF  C0402  [0402]
C139  20nF  C0402  [0402]
C140  100nF  C0402  [0402]
C141  100nF  C0402  [0402]
C142  20nF  C0402  [0402]
C143  100nF  C0402  [0402]
C144  100nF  C0402  [0402]
C145  20nF  C0402  [0402]
C146  100nF  C0402  [0402]
C147  100nF  C0402  [0402]
C148  20nF  C0402  [0402]
C149  100nF  C0402  [0402]
C150  100nF  C0402  [0402]
IC22  DAC8568  [TSSOP16]
IC23  MCP6001RT  [SOT23-5]
IC24  MCP6001RT  [SOT23-5]
IC25  MCP6001RT  [SOT23-5]
IC26  MCP6001RT  [SOT23-5]
IC27  MCP6001RT  [SOT23-5]
IC28  MCP6001RT  [SOT23-5]
IC29  MCP6001RT  [SOT23-5]
IC30  MCP6001RT  [SOT23-5]
IC31  MCP6001RT  [SOT23-5]
R86  CRA034RF100RP05Z  YC164-JR-0733RL  [YC164-JR-0733RL]
R87  10K 0.1%  R0402  [0402]
R88  10K 0.1%  R0402  [0402]
R89  43K 0.1%  R0402  [0402]
R90  68R 1%  R0402  [0402]
R91  10K 0.1%  R0402  [0402]
R92  10K 0.1%  R0402  [0402]
R93  43K 0.1%  R0402  [0402]
R94  68R 1%  R0402  [0402]
R95  10K 0.1%  R0402  [0402]
R96  10K 0.1%  R0402  [0402]
R97  43K 0.1%  R0402  [0402]
R98  68R 1%  R0402  [0402]
R99  10K 0.1%  R0402  [0402]
R100  10K 0.1%  R0402  [0402]
R101  43K 0.1%  R0402  [0402]
R102  68R 1%  R0402  [0402]
R103  10K 0.1%  R0402  [0402]
R104  10K 0.1%  R0402  [0402]
R105  43K 0.1%  R0402  [0402]
R106  68R 1%  R0402  [0402]
R107  10K 0.1%  R0402  [0402]
R108  10K 0.1%  R0402  [0402]
R109  43K 0.1%  R0402  [0402]
R110  68R 1%  R0402  [0402]
R111  10K 0.1%  R0402  [0402]
R112  10K 0.1%  R0402  [0402]
R113  43K 0.1%  R0402  [0402]
R114  68R 1%  R0402  [0402]
R115  10K 0.1%  R0402  [0402]
R116  10K 0.1%  R0402  [0402]
R117  43K 0.1%  R0402  [0402]
R118  68R 1%  R0402  [0402]
TP89  PTR1B1,27  [B1,27]
TP90  PTR1B1,27  [B1,27]
TP91  PTR1B1,27  [B1,27]
TP92  PTR1B1,27  [B1,27]
TP93  PTR1B1,27  [B1,27]
TP94  PTR1B1,27  [B1,27]
TP95  PTR1B1,27  [B1,27]
TP96  PTR1B1,27  [B1,27]
TP97  PTR1B1,27  [B1,27]
TP98  PTR1B1,27  [B1,27]
TP99  PTR1B1,27  [B1,27]
TP100  PTR1B1,27  [B1,27]

### Nets
+3V3: C122.1 C123.1 C126.1 C128.1 C131.1 C134.1 C137.1 C140.1 C143.1 C146.1 C149.1 IC22.3(AVDD) IC23.2(V+) IC24.2(V+) IC25.2(V+) IC26.2(V+) IC27.2(V+) IC28.2(V+) IC29.2(V+) IC30.2(V+) IC31.2(V+) R86.6 R86.7 R86.8 ; also sheet 3,4,5,7
AO_0: C127.1 R89.2 R90.2 ; also sheet 8
AO_1: C130.1 R93.2 R94.2 ; also sheet 8
AO_2: C133.1 R97.2 R98.2 ; also sheet 8
AO_3: C136.1 R101.2 R102.2 ; also sheet 8
AO_4: C139.1 R105.2 R106.2 ; also sheet 8
AO_5: C142.1 R109.2 R110.2 ; also sheet 8
AO_6: C145.1 R113.2 R114.2 ; also sheet 8
AO_7: C148.1 R117.2 R118.2 ; also sheet 8
DAC_0: IC22.4(VOUT_A) IC24.3(+IN) TP90.TP
DAC_1: IC22.13(VOUT_B) IC25.3(+IN) TP92.TP
DAC_2: IC22.5(VOUT_C) IC26.3(+IN) TP94.TP
DAC_3: IC22.12(VOUT_D) IC27.3(+IN) TP96.TP
DAC_4: IC22.6(VOUT_E) IC28.3(+IN) TP97.TP
DAC_5: IC22.11(VOUT_F) IC29.3(+IN) TP98.TP
DAC_6: IC22.7(VOUT_G) IC30.3(+IN) TP99.TP
DAC_7: IC22.10(VOUT_H) IC31.3(+IN) TP100.TP
DAC_!CLR: IC22.9(!CLR) R86.1 TP93.TP ; also sheet 4
DAC_!LDAC: IC22.1(!LDAC) R86.3 TP89.TP ; also sheet 4
DAC_!SYNC: IC22.2(!SYNC) R86.2 TP91.TP ; also sheet 4
GND: C122.2 C123.2 C124.2 C125.2 C126.2 C127.2 C128.2 C130.2 C131.2 C133.2 C134.2 C136.2 C137.2 C139.2 C140.2 C142.2 C143.2 C145.2 C146.2 C148.2 C149.2 IC22.14(GND) IC23.5(V-) IC24.5(V-) IC25.5(V-) IC26.5(V-) IC27.5(V-) IC28.5(V-) IC29.5(V-) IC30.5(V-) IC31.5(V-) R87.1 R91.1 R95.1 R99.1 R103.1 R107.1 R111.1 R115.1 ; also sheet 2,3,4,5,7,8
MOSI: IC22.15(DIN) ; also sheet 4,5,7
N$14: C129.2 IC24.1(OUT) R90.1
N$17: C129.1 IC24.4(-IN) R87.2 R88.2 R89.1
N$22: C132.1 IC25.4(-IN) R91.2 R92.2 R93.1
N$23: C132.2 IC25.1(OUT) R94.1
N$25: C135.1 IC26.4(-IN) R95.2 R96.2 R97.1
N$26: C135.2 IC26.1(OUT) R98.1
N$27: C138.1 IC27.4(-IN) R99.2 R100.2 R101.1
N$28: C138.2 IC27.1(OUT) R102.1
N$31: C141.1 IC28.4(-IN) R103.2 R104.2 R105.1
N$33: C141.2 IC28.1(OUT) R106.1
N$34: C144.1 IC29.4(-IN) R107.2 R108.2 R109.1
N$40: C144.2 IC29.1(OUT) R110.1
N$41: C147.1 IC30.4(-IN) R111.2 R112.2 R113.1
N$58: C147.2 IC30.1(OUT) R114.1
N$59: C150.1 IC31.4(-IN) R115.2 R116.2 R117.1
N$60: C150.2 IC31.1(OUT) R118.1
SCK: IC22.16(SCLK) ; also sheet 4,5,7
VREF_DAC: C125.1 IC23.1(OUT) IC23.4(-IN) R88.1 R92.1 R96.1 R100.1 R104.1 R108.1 R112.1 R116.1
VREF_DAC_OUT: C124.1 IC22.8(VREF_IO) IC23.3(+IN) TP95.TP
Unconnected: R86.4 R86.5

### Notes on the sheet
- ANALOG-OUT DAC | ANALOG-OUT OUTPUT DRIVERS
- Choose R_ISOLATION = 68 Ω:
  
  1. Stability with Capacitive Load:
  The combination of R_ISO and C_LOAD
  creates a low-pass filter. The cutoff frequency is:
  f_c = 1 / (2 * π * R_ISO * C_LOAD)
  For R_ISO = 68 Ω and C_LOAD = 20 nF:
  f_c = 1 / (2 * π * 68 * 20e-9) ≈ 117.2 kHz
  
  2. Voltage Drop Across R_ISO:
  The voltage drop is:
  V_drop = I_load * R_ISO
- ANALOG-OUT TESTPOINTS
- ANALOG OUTPUT
- https://github.com/DvidMakesThings
- v1.0
- DAC8568 Output Calculation:
  V_OUT = (1 + R_FB/R_G2 + R_FB/R_G1) * V_DAC - (R_FB/R_G2) * V_REF
  
  Given:
  Supply voltage: +/-12V
  Reference voltage (V_REF): 2.5V
  DAC resolution: 16 bits
  Desired output range: -12V to +12V
  
  1. Determine the Gain (G):
  G = (V_OUT_max - V_OUT_min) / (V_DAC_max - V_DAC_min)
  G = (12 - (-12)) / (2.5 - 0) = 24 / 2.5 = 9.6
  
  2. Solve for Resistor Ratios:
  G = 1 + R_FB/R_G2 + R_FB/R_G1
  Assume R_G1 = R_G2 = R_G:
  G = 1 + 2 * (R_FB / R_G)
  9.6 = 1 + 2 * (R_FB / R_G)
  2 * (R_FB / R_G) = 8.6
  R_FB / R_G = 4.3
  
  3. Choose Resistor Values:
  Let R_G = 10 kOhm
  R_FB = 4.3 * R_G = 4.3 * 10 kOhm = 43 kOhm
  
  Resistor Values:
  R_FB = 43 kOhm
  R_G1 = R_G2 = 10 kOhm
  
  4. Calculate Output Resolution:
  Resolution_DAC = V_REF / 2^16 = 2.5 / 65536 ≈ 0.038 mV
  Resolution_OUT = Resolution_DAC * G = 0.038 mV * 9.6 ≈ 0.365 mV
  
  Final Results:
  Resistor values:
  R_FB = 43 kOhm
  R_G1 = R_G2 = 10 kOhm
  Output resolution: 0.365 mV per step

## Sheet 7 of 8: Digital IO
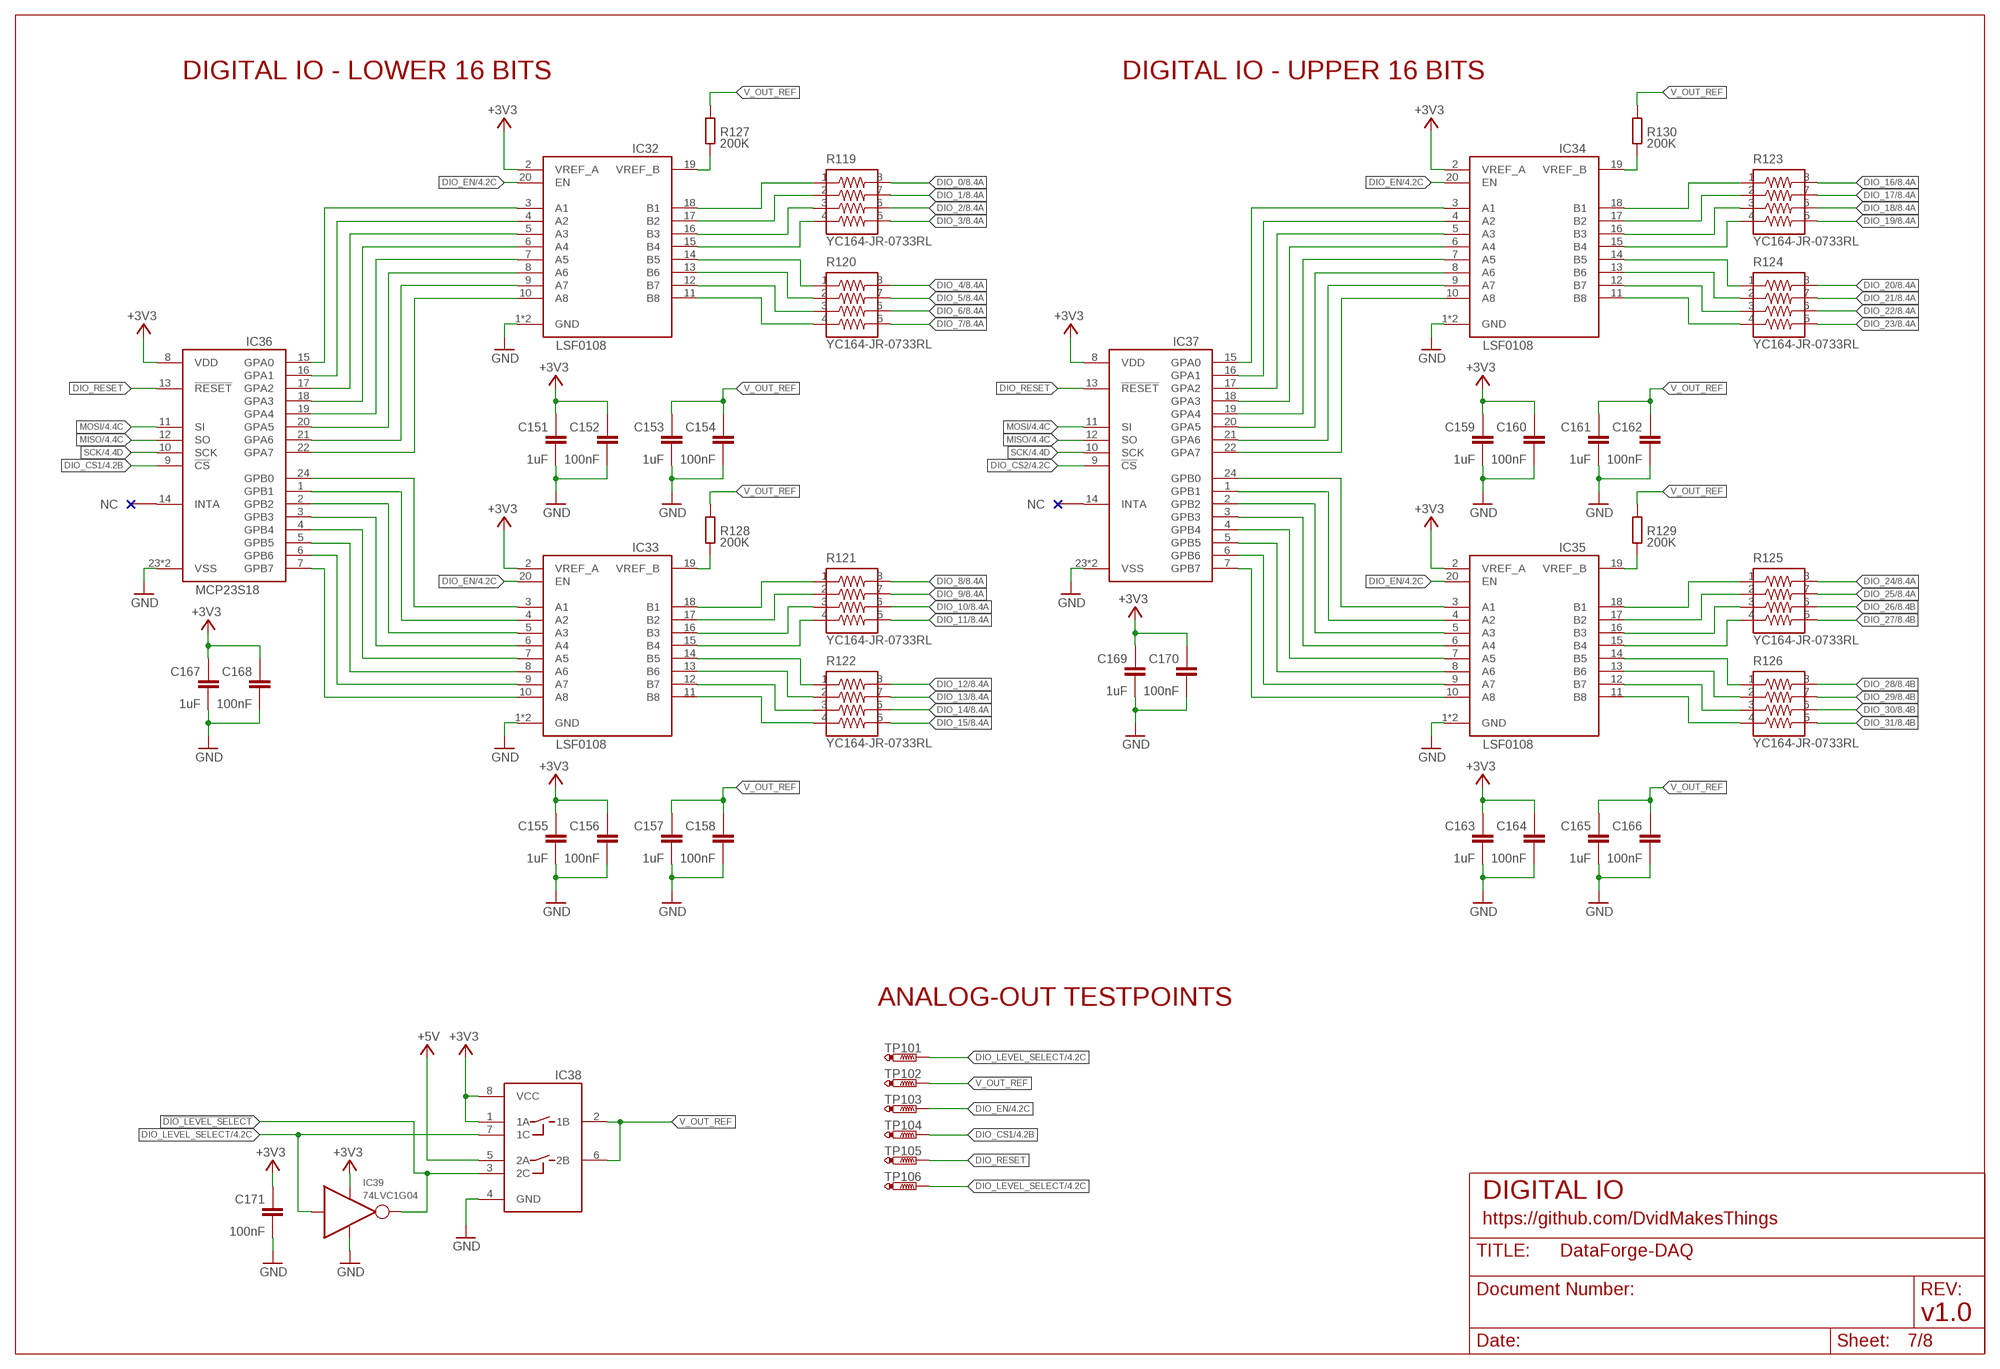
[diagram p6: schematic, sheet 7]

### Parts
C151  1uF  C0603  [0603]
C152  100nF  C0603  [0603]
C153  1uF  C0603  [0603]
C154  100nF  C0603  [0603]
C155  1uF  C0603  [0603]
C156  100nF  C0603  [0603]
C157  1uF  C0603  [0603]
C158  100nF  C0603  [0603]
C159  1uF  C0603  [0603]
C160  100nF  C0603  [0603]
C161  1uF  C0603  [0603]
C162  100nF  C0603  [0603]
C163  1uF  C0603  [0603]
C164  100nF  C0603  [0603]
C165  1uF  C0603  [0603]
C166  100nF  C0603  [0603]
C167  1uF  C0603  [0603]
C168  100nF  C0603  [0603]
C169  1uF  C0603  [0603]
C170  100nF  C0603  [0603]
C171  100nF  C0603  [0603]
IC32  LSF0108  LSF0108-Q1  [VQFN20]
IC33  LSF0108  LSF0108-Q1  [VQFN20]
IC34  LSF0108  LSF0108-Q1  [VQFN20]
IC35  LSF0108  LSF0108-Q1  [VQFN20]
IC36  MCP23S18  [QFN50P400X400X100-25T265]
IC37  MCP23S18  [QFN50P400X400X100-25T265]
IC38  SN74LVC2G66  [SOP50P310X90-8N]
IC39  74LVC1G04  [SOT95P280X145-5N]
R119  YC164-JR-0733RL  [YC164-JR-0733RL]
R120  YC164-JR-0733RL  [YC164-JR-0733RL]
R121  YC164-JR-0733RL  [YC164-JR-0733RL]
R122  YC164-JR-0733RL  [YC164-JR-0733RL]
R123  YC164-JR-0733RL  [YC164-JR-0733RL]
R124  YC164-JR-0733RL  [YC164-JR-0733RL]
R125  YC164-JR-0733RL  [YC164-JR-0733RL]
R126  YC164-JR-0733RL  [YC164-JR-0733RL]
R127  200K  R0402  [0402]
R128  200K  R0402  [0402]
R129  200K  R0402  [0402]
R130  200K  R0402  [0402]
TP101  PTR1B1,27  [B1,27]
TP102  PTR1B1,27  [B1,27]
TP103  PTR1B1,27  [B1,27]
TP104  PTR1B1,27  [B1,27]
TP105  PTR1B1,27  [B1,27]
TP106  PTR1B1,27  [B1,27]

### Nets
!DIO_LEVEL_SELECT: IC38.3(2C) IC39.4(OUT)
+3V3: C151.1 C152.1 C155.1 C156.1 C159.1 C160.1 C163.1 C164.1 C167.1 C168.1 C169.1 C170.1 C171.1 IC32.2(VREF_A) IC33.2(VREF_A) IC34.2(VREF_A) IC35.2(VREF_A) IC36.8(VDD) IC37.8(VDD) IC38.1(1A) IC38.8(VCC) IC39.5(V+) ; also sheet 3,4,5,6
+5V: IC38.5(2A) ; also sheet 2,3
DIO_0: R119.8 ; also sheet 8
DIO_1: R119.7 ; also sheet 8
DIO_2: R119.6 ; also sheet 8
DIO_3: R119.5 ; also sheet 8
DIO_4: R120.8 ; also sheet 8
DIO_5: R120.7 ; also sheet 8
DIO_6: R120.6 ; also sheet 8
DIO_7: R120.5 ; also sheet 8
DIO_8: R121.8 ; also sheet 8
DIO_9: R121.7 ; also sheet 8
DIO_10: R121.6 ; also sheet 8
DIO_11: R121.5 ; also sheet 8
DIO_12: R122.8 ; also sheet 8
DIO_13: R122.7 ; also sheet 8
DIO_14: R122.6 ; also sheet 8
DIO_15: R122.5 ; also sheet 8
DIO_16: R123.8 ; also sheet 8
DIO_17: R123.7 ; also sheet 8
DIO_18: R123.6 ; also sheet 8
DIO_19: R123.5 ; also sheet 8
DIO_20: R124.8 ; also sheet 8
DIO_21: R124.7 ; also sheet 8
DIO_22: R124.6 ; also sheet 8
DIO_23: R124.5 ; also sheet 8
DIO_24: R125.8 ; also sheet 8
DIO_25: R125.7 ; also sheet 8
DIO_26: R125.6 ; also sheet 8
DIO_27: R125.5 ; also sheet 8
DIO_28: R126.8 ; also sheet 8
DIO_29: R126.7 ; also sheet 8
DIO_30: R126.6 ; also sheet 8
DIO_31: R126.5 ; also sheet 8
DIO_CS1: IC36.9(!CS) TP104.TP ; also sheet 4
DIO_CS2: IC37.9(!CS) ; also sheet 4
DIO_EN: IC32.20(EN) IC33.20(EN) IC34.20(EN) IC35.20(EN) TP103.TP ; also sheet 4
DIO_LEVEL_SELECT: IC38.7(1C) IC39.2(IN) TP101.TP TP106.TP ; also sheet 4
DIO_RESET: IC36.13(!RESET) IC37.13(!RESET) TP105.TP
GND: C151.2 C152.2 C153.2 C154.2 C155.2 C156.2 C157.2 C158.2 C159.2 C160.2 C161.2 C162.2 C163.2 C164.2 C165.2 C166.2 C167.2 C168.2 C169.2 C170.2 C171.2 IC32.1(GND) IC32.PAD(GND) IC33.1(GND) IC33.PAD(GND) IC34.1(GND) IC34.PAD(GND) IC35.1(GND) IC35.PAD(GND) IC36.23(VSS) IC36.25(VSS) IC37.23(VSS) IC37.25(VSS) IC38.4(GND) IC39.3(V-) ; also sheet 2,3,4,5,6,8
MISO: IC36.12(SO) IC37.12(SO) ; also sheet 4,5
MOSI: IC36.11(SI) IC37.11(SI) ; also sheet 4,5,6
N$29: IC33.4(A2) IC36.1(GPB1)
N$61: IC32.3(A1) IC36.15(GPA0)
N$62: IC32.4(A2) IC36.16(GPA1)
N$63: IC32.5(A3) IC36.17(GPA2)
N$64: IC32.6(A4) IC36.18(GPA3)
N$65: IC32.7(A5) IC36.19(GPA4)
N$66: IC32.8(A6) IC36.20(GPA5)
N$67: IC32.9(A7) IC36.21(GPA6)
N$68: IC32.10(A8) IC36.22(GPA7)
N$69: IC32.18(B1) R119.1
N$70: IC32.17(B2) R119.2
N$71: IC32.16(B3) R119.3
N$72: IC32.15(B4) R119.4
N$73: IC32.14(B5) R120.1
N$74: IC32.13(B6) R120.2
N$75: IC32.12(B7) R120.3
N$76: IC32.11(B8) R120.4
N$77: IC33.3(A1) IC36.24(GPB0)
N$78: IC33.5(A3) IC36.2(GPB2)
N$79: IC33.6(A4) IC36.3(GPB3)
N$80: IC33.7(A5) IC36.4(GPB4)
N$81: IC33.8(A6) IC36.5(GPB5)
N$82: IC33.9(A7) IC36.6(GPB6)
N$83: IC33.10(A8) IC36.7(GPB7)
N$84: IC33.18(B1) R121.1
N$85: IC33.17(B2) R121.2
N$86: IC33.16(B3) R121.3
N$87: IC33.15(B4) R121.4
N$88: IC33.14(B5) R122.1
N$89: IC33.13(B6) R122.2
N$90: IC33.12(B7) R122.3
N$91: IC33.11(B8) R122.4
N$92: IC34.3(A1) IC37.15(GPA0)
N$93: IC34.4(A2) IC37.16(GPA1)
N$94: IC34.5(A3) IC37.17(GPA2)
N$95: IC34.6(A4) IC37.18(GPA3)
N$96: IC34.7(A5) IC37.19(GPA4)
N$97: IC34.8(A6) IC37.20(GPA5)
N$98: IC34.9(A7) IC37.21(GPA6)
N$99: IC34.10(A8) IC37.22(GPA7)
N$100: IC34.18(B1) R123.1
N$101: IC34.17(B2) R123.2
N$102: IC34.16(B3) R123.3
N$103: IC34.15(B4) R123.4
N$104: IC34.14(B5) R124.1
N$105: IC34.13(B6) R124.2
N$106: IC34.12(B7) R124.3
N$107: IC34.11(B8) R124.4
N$108: IC35.5(A3) IC37.2(GPB2)
N$109: IC35.6(A4) IC37.3(GPB3)
N$110: IC35.7(A5) IC37.4(GPB4)
N$111: IC35.8(A6) IC37.5(GPB5)
N$112: IC35.9(A7) IC37.6(GPB6)
N$113: IC35.10(A8) IC37.7(GPB7)
N$114: IC35.4(A2) IC37.1(GPB1)
N$115: IC35.3(A1) IC37.24(GPB0)
N$116: IC35.18(B1) R125.1
N$117: IC35.17(B2) R125.2
N$118: IC35.16(B3) R125.3
N$119: IC35.15(B4) R125.4
N$120: IC35.14(B5) R126.1
N$121: IC35.13(B6) R126.2
N$122: IC35.12(B7) R126.3
N$123: IC35.11(B8) R126.4
N$124: IC32.19(VREF_B) R127.1
N$125: IC33.19(VREF_B) R128.1
N$126: IC35.19(VREF_B) R129.1
N$127: IC34.19(VREF_B) R130.1
SCK: IC36.10(SCK) IC37.10(SCK) ; also sheet 4,5,6
V_OUT_REF: C153.1 C154.1 C157.1 C158.1 C161.1 C162.1 C165.1 C166.1 IC38.2(1B) IC38.6(2B) R127.2 R128.2 R129.2 R130.2 TP102.TP
Unconnected: IC36.14(INTA) IC37.14(INTA)

### Notes on the sheet
- DIGITAL IO - LOWER 16 BITS | DIGITAL IO - UPPER 16 BITS
- ANALOG-OUT TESTPOINTS
- DIGITAL IO
- https://github.com/DvidMakesThings
- v1.0

## Sheet 8 of 8: Output connectors
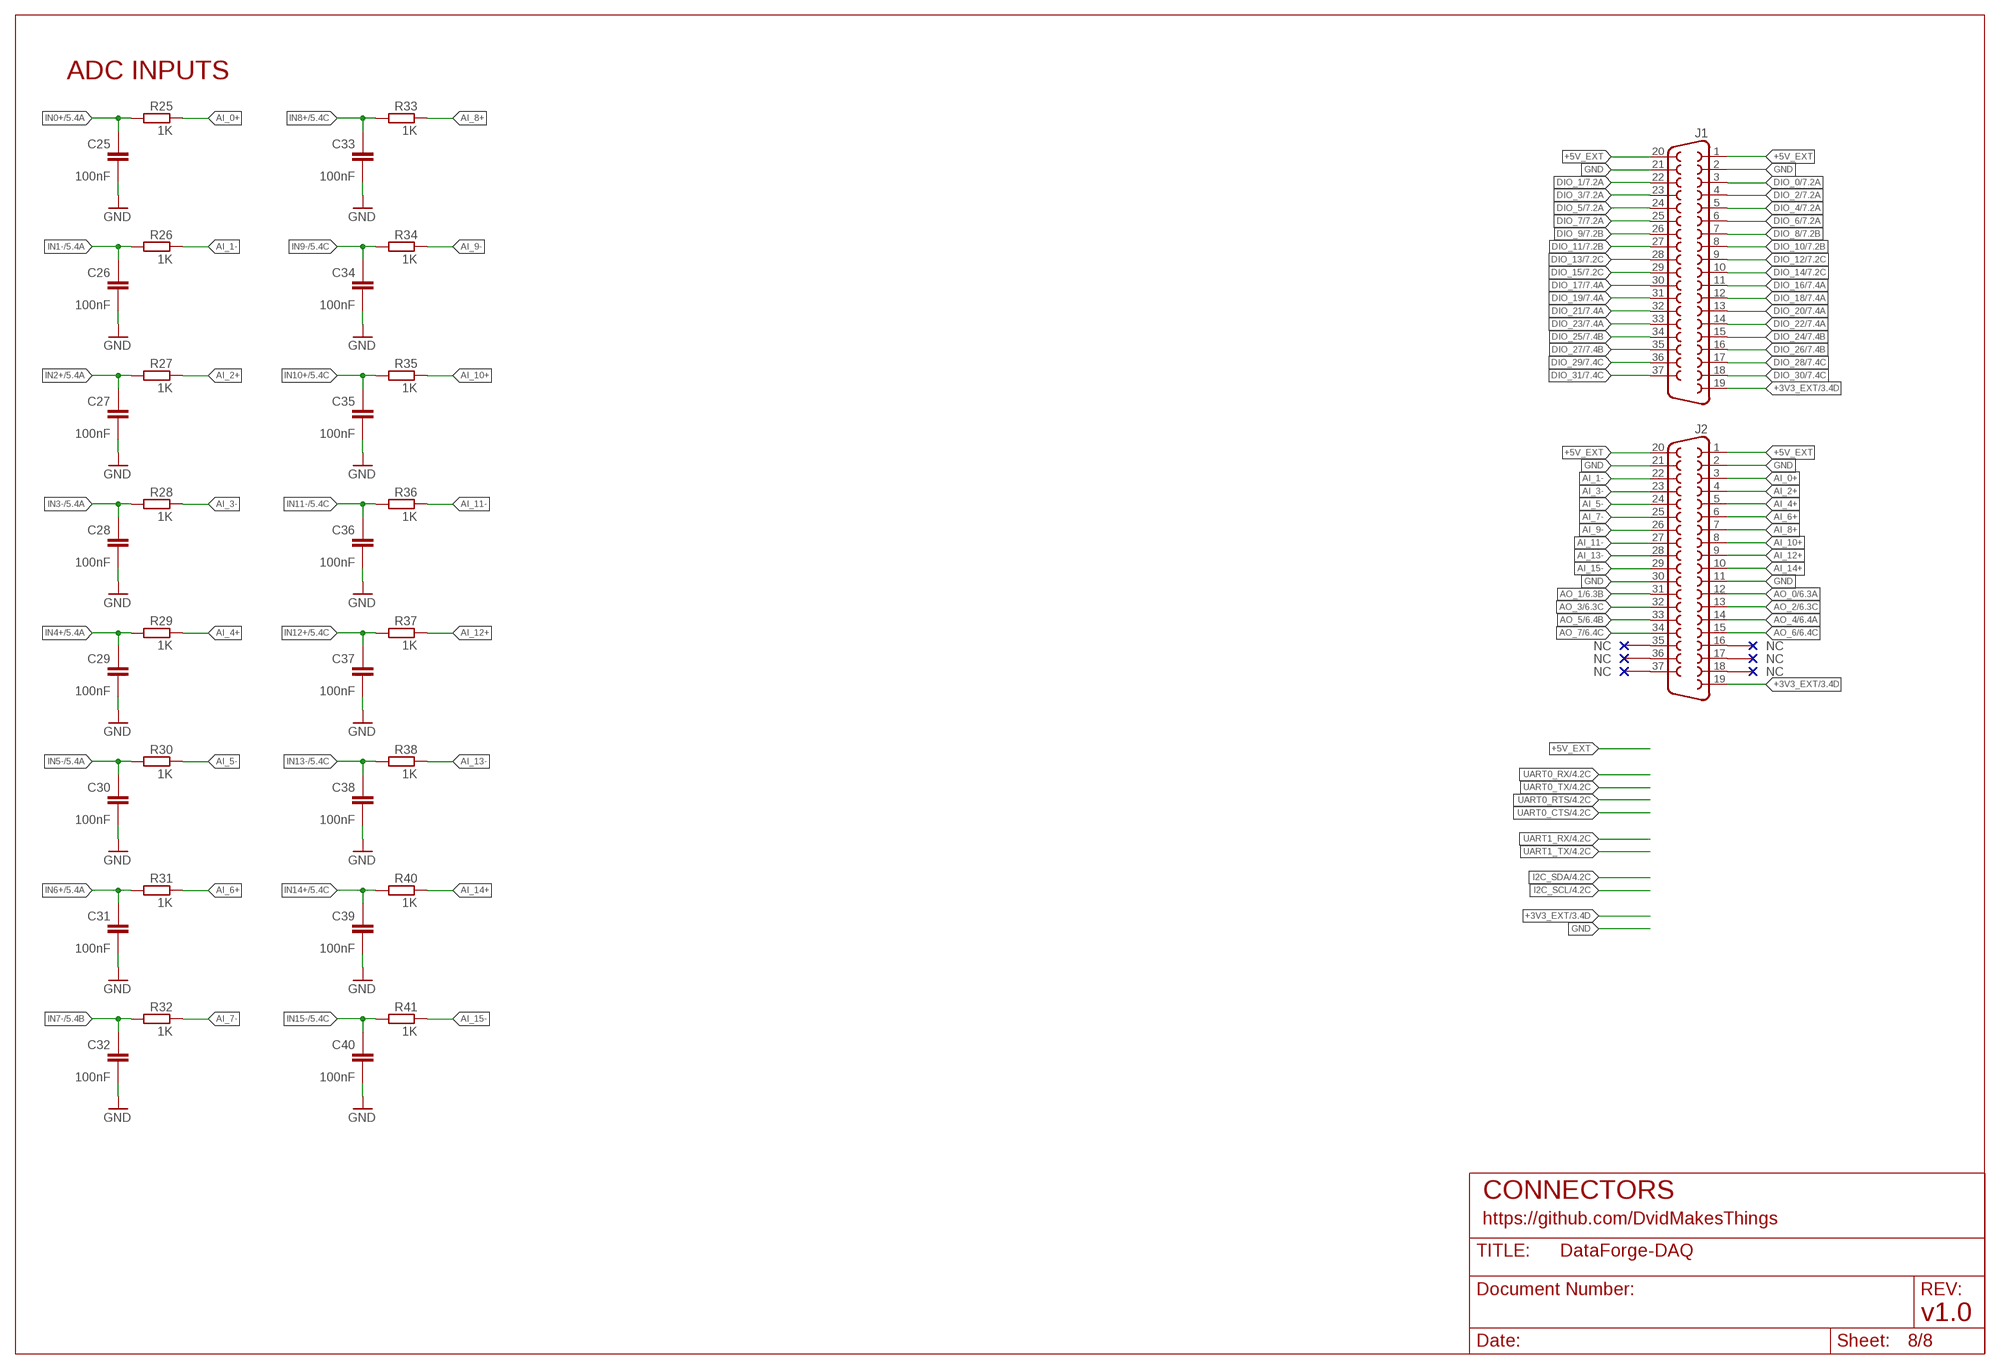
[diagram p7: schematic, sheet 8]

### Parts
C25  100nF  C0603  [0603]
C26  100nF  C0603  [0603]
C27  100nF  C0603  [0603]
C28  100nF  C0603  [0603]
C29  100nF  C0603  [0603]
C30  100nF  C0603  [0603]
C31  100nF  C0603  [0603]
C32  100nF  C0603  [0603]
C33  100nF  C0603  [0603]
C34  100nF  C0603  [0603]
C35  100nF  C0603  [0603]
C36  100nF  C0603  [0603]
C37  100nF  C0603  [0603]
C38  100nF  C0603  [0603]
C39  100nF  C0603  [0603]
C40  100nF  C0603  [0603]
J1  F37V  [F37V]
J2  F37V  [F37V]
R25  1K  R0603  [0603]
R26  1K  R0603  [0603]
R27  1K  R0603  [0603]
R28  1K  R0603  [0603]
R29  1K  R0603  [0603]
R30  1K  R0603  [0603]
R31  1K  R0603  [0603]
R32  1K  R0603  [0603]
R33  1K  R0603  [0603]
R34  1K  R0603  [0603]
R35  1K  R0603  [0603]
R36  1K  R0603  [0603]
R37  1K  R0603  [0603]
R38  1K  R0603  [0603]
R40  1K  R0603  [0603]
R41  1K  R0603  [0603]

### Nets
+3V3_EXT: J1.19 J2.19 ; also sheet 3
+5V_EXT: J1.1 J1.20 J2.1 J2.20
AI_0+: J2.3 R25.1
AI_1-: J2.22 R26.1
AI_2+: J2.4 R27.1
AI_3-: J2.23 R28.1
AI_4+: J2.5 R29.1
AI_5-: J2.24 R30.1
AI_6+: J2.6 R31.1
AI_7-: J2.25 R32.1
AI_8+: J2.7 R33.1
AI_9-: J2.26 R34.1
AI_10+: J2.8 R35.1
AI_11-: J2.27 R36.1
AI_12+: J2.9 R37.1
AI_13-: J2.28 R38.1
AI_14+: J2.10 R40.1
AI_15-: J2.29 R41.1
AO_0: J2.12 ; also sheet 6
AO_1: J2.31 ; also sheet 6
AO_2: J2.13 ; also sheet 6
AO_3: J2.32 ; also sheet 6
AO_4: J2.14 ; also sheet 6
AO_5: J2.33 ; also sheet 6
AO_6: J2.15 ; also sheet 6
AO_7: J2.34 ; also sheet 6
DIO_0: J1.3 ; also sheet 7
DIO_1: J1.22 ; also sheet 7
DIO_2: J1.4 ; also sheet 7
DIO_3: J1.23 ; also sheet 7
DIO_4: J1.5 ; also sheet 7
DIO_5: J1.24 ; also sheet 7
DIO_6: J1.6 ; also sheet 7
DIO_7: J1.25 ; also sheet 7
DIO_8: J1.7 ; also sheet 7
DIO_9: J1.26 ; also sheet 7
DIO_10: J1.8 ; also sheet 7
DIO_11: J1.27 ; also sheet 7
DIO_12: J1.9 ; also sheet 7
DIO_13: J1.28 ; also sheet 7
DIO_14: J1.10 ; also sheet 7
DIO_15: J1.29 ; also sheet 7
DIO_16: J1.11 ; also sheet 7
DIO_17: J1.30 ; also sheet 7
DIO_18: J1.12 ; also sheet 7
DIO_19: J1.31 ; also sheet 7
DIO_20: J1.13 ; also sheet 7
DIO_21: J1.32 ; also sheet 7
DIO_22: J1.14 ; also sheet 7
DIO_23: J1.33 ; also sheet 7
DIO_24: J1.15 ; also sheet 7
DIO_25: J1.34 ; also sheet 7
DIO_26: J1.16 ; also sheet 7
DIO_27: J1.35 ; also sheet 7
DIO_28: J1.17 ; also sheet 7
DIO_29: J1.36 ; also sheet 7
DIO_30: J1.18 ; also sheet 7
DIO_31: J1.37 ; also sheet 7
GND: C25.2 C26.2 C27.2 C28.2 C29.2 C30.2 C31.2 C32.2 C33.2 C34.2 C35.2 C36.2 C37.2 C38.2 C39.2 C40.2 J1.2 J1.21 J2.2 J2.11 J2.21 J2.30 ; also sheet 2,3,4,5,6,7
IN0+: C25.1 R25.2 ; also sheet 5
IN1-: C26.1 R26.2 ; also sheet 5
IN2+: C27.1 R27.2 ; also sheet 5
IN3-: C28.1 R28.2 ; also sheet 5
IN4+: C29.1 R29.2 ; also sheet 5
IN5-: C30.1 R30.2 ; also sheet 5
IN6+: C31.1 R31.2 ; also sheet 5
IN7-: C32.1 R32.2 ; also sheet 5
IN8+: C33.1 R33.2 ; also sheet 5
IN9-: C34.1 R34.2 ; also sheet 5
IN10+: C35.1 R35.2 ; also sheet 5
IN11-: C36.1 R36.2 ; also sheet 5
IN12+: C37.1 R37.2 ; also sheet 5
IN13-: C38.1 R38.2 ; also sheet 5
IN14+: C39.1 R40.2 ; also sheet 5
IN15-: C40.1 R41.2 ; also sheet 5
Unconnected: J2.16 J2.17 J2.18 J2.35 J2.36 J2.37

### Notes on the sheet
- ADC INPUTS
- CONNECTORS
- https://github.com/DvidMakesThings
- v1.0

## Library data of the parts
C1-C117 C120-C171 = ds_passive:C
C118 C119 = rcl:CPOL-EU: POLARIZED CAPACITOR, European symbol; SPICEPREFIX: C
D1 D2 = Diodes:SS12: DIODE SCHOTTKY 20V 1A SMA Manufacturer's datasheet <https://www.onsemi.com/pub/Collateral/SS19-D.PDF>; CREATED_BY: PCBLayout.com; DIGIKEY_PART_NUMBER: SS12FSCT-ND; MANUFACTURER: ON Semiconductor; MPN: SS12; PACKAGE: SMA (DO-214AC)
ESD1 = ds_ic_peripherals:SP0503BAHT: TVS Diode Arrays Surface Mount TVS Avalanche Diode Array
F1 = Fuse:3413.0326.22: FUSE BRD MNT 7A 32VAC 63VDC 1206 Manufacturer's datasheet <https://us.schurter.com/en/datasheet/typ_UST_1206.pdf>; CREATED_BY: PCBLayout.com; DIGIKEY_PARTNO: 486-1684-2-ND; MANUFACTURER: Schurter Inc.; MPN: 3413.0326.22
IC1 = ds_ic_mcu:RP2350B: RP2350 is a new family of microcontrollers from Raspberry Pi that offers significant enhancements over RP2040. Key features include: • Dual Cortex-M33 or Hazard3 processors at 150 MHz • 520 kB on-chip SRAM, in 10 independent banks • 8 kB of one-time-programmable storage (OTP) • Up to 16 MB of external QSPI flash/PSRAM via dedicated QSPI bus - Additional 16 MB flash/PSRAM accessible via optional second chip-select • On-chip switched-mode power supply to generate core voltage - Low-quiescent-current LDO mode can be enabled for sleep states • 2× on-chip PLLs for internal or external clock generation • Security features: - Optional boot signing, enforced by on-chip mask ROM, with key fingerprint in OTP - Protected OTP storage for optional boot decryption key - Global bus filtering based on Arm or RISC-V security/privilege levels - Peripherals, GPIOs and DMA channels individually assignable to security domains - Hardware mitigations for fault injection attacks - Hardware SHA-256 accelerator • Peripherals: - 2× UARTs - 2× SPI controllers - 2× I2C controllers - 24× PWM channels - USB 1.1 controller and PHY, with host and device support - 12× PIO state machines - 1× HSTX peripheral
IC2 IC3 = ds_ic_memory:W25Q128JV: 3V 128M-BIT SERIAL FLASH MEMORY WITH DUAL/QUAD SPI & QPI & DTR
IC4 = ds_ic_peripherals:ADS9234R: ADS92x4R Dual, Low-Latency, Simultaneous-Sampling SAR ADC
IC5 IC7 = ds_ic_peripherals:DG409: DG409 is a dual 4 channel differential analog multiplexer designed to connect one of four differential inputs to a common dual output as determined by its 2-bit binary address (A0, A1)
IC6 IC8 = ds_ic_opa:ADA4254: Zero Drift, High Voltage, Low Power, Programmable Gain Instrumentation Amplifier
IC9 = maxim:MAX6520: 1.2V Voltage Reference 50ppm/°C, SOT23, 3-Terminal Source: Data sheet <http://datasheets.maxim-ic.com/en/ds/MAX6520.pdf>; MF: MAXIM; MPN: MAX6520EUR-T; OC_FARNELL: unknown; OC_NEWARK: 02J4586
IC10 IC11 IC23-IC31 = ds_ic_opa:MCP6001RT: 1 MHz, Low-Power Op Amp
IC12 = ds_ic_vreg:CYPD3177: USB Type-C Port Controller for Power Sinks EZ-PD™ BCR is Cypress’ highly-integrated pre-programmed USB Type-C port controller targeting electronic devices that have legacy barrel connectors (up to 100W) or USB micro-B connectors for power such as drones, smart speakers, power tools, and other rechargeable devices. EZ-PD BCR complies with the latest USB Type-C and USB Power Delivery (PD) standards and enables users to quickly convert their devices from being powered through a barrel connector to being powered via the USB-C connector with few external components and no firmware development is required. EZ-PD BCR integrates a complete USB Type-C transceiver, USB PD policy manager, a load switch controller with a soft start, all termination resistors required for a USB Type-C port, and system-level ESD protection. It is available in a 24-pin QFN package.
IC13 = ds_ic_peripherals:INA180: INAx180 Low- and High-Side Voltage Output, Current-Sense Amplifiers
IC14 = ds_ic_vreg:TPS65131: Positive- and Negative-Output DC-DC Converter
IC15 = ds_ic_vreg:TPS7A39: Dual, 150-mA, Wide VIN Positive and Negative LDO Voltage Regulator
IC16 IC17 = ds_ic_logic:74LVC08A: Quad 2-input AND gate
IC18 = ds_ic_logic:74LVC32A: Quad 2-input OR gate
IC19 = 74xx-little-us:74*1G04: INVERTER Gate
IC20 = ds_ic_vreg:MIC5504-3.3YM5-TR: The MIC5501/2/3/4 is an advanced general-purpose LDO ideal for powering general-purpose portable devices. The MIC5501/2/3/4 family of products provides a high-performance 300mA LDO
IC21 = v-reg:LD117A?*: Low drop fixed and adjustable positive voltage regulators 1 A Source: http://www.st.com/stonline/products/literature/ds/7194/ld1117axx.pdf
IC22 = ds_ic_peripherals:DAC8568: Octal-Channel, Ultralow Glitch, Voltage Output, Digital-to-Analog Converters with 2.5-V 2-ppm/°C Internal Reference
IC32-IC35 = ds_ic_peripherals:LSF0108: Automotive 8-Channel Multi-Voltage Level Translator
IC36 IC37 = ds_ic_peripherals:MCP23S18: 16-Bit I/O Expander with Open-Drain Outputs
IC38 = ds_ic_peripherals:SN74LVC2G66: Dual Bilateral Analog Switch
IC39 = ds_ic_logic:74LVC1G04: Single inverter
J1 J2 = con-subd:F37: SUB-D; OC_FARNELL: unknown; OC_NEWARK: unknown
L1 R1-R10 R13-R18 R20-R38 R40-R48 R50-R62 R64-R74 R76 R81-R85 R87-R118 R127-R130 = ds_passive:R
L3 L4 = inductor-coilcraft:MSS7341: Shielded Power Inductors Package 6.6 × 6.6 mm x 4.1 mm high Source: http://www.farnell.com/datasheets/1681958.pdf
LED1 POWER = led:LED: LED OSRAM: - CHIPLED LG R971, LG N971, LY N971, LG Q971, LY Q971, LO R971, LY R971 LH N974, LH R974 LS Q976, LO Q976, LY Q976 LO Q996 - Hyper CHIPLED LW Q18S LB Q993, LB Q99A, LB R99A - SideLED LS A670, LO A670, LY A670, LG A670, LP A670 LB A673, LV A673, LT A673, LW A673 LH A674 LY A675 LS A676, LA A676, LO A676, LY A676, LW A676 LS A679, LY A679, LG A679 - Hyper Micro SIDELED® LS Y876, LA Y876, LO Y876, LY Y876 LT Y87S - SmartLED LW L88C, LW L88S LB L89C, LB L89S, LG L890 LS L89K, LO L89K, LY L89K LS L896, LA L896, LO L896, LY L896 - TOPLED LS T670, LO T670, LY T670, LG T670, LP T670 LSG T670, LSP T670, LSY T670, LOP T670, LYG T670 LG T671, LOG T671, LSG T671 LB T673, LV T673, LT T673, LW T673 LH T674 LS T676, LA T676, LO T676, LY T676, LB T676, LH T676, LSB T676, LW T676 LB T67C, LV T67C, LT T67C, LS T67K, LO T67K, LY T67K, LW E67C LS E67B, LA E67B, LO E67B, LY E67B, LB E67C, LV E67C, LT E67C LW T67C LS T679, LY T679, LG T679 LS T770, LO T770, LY T770, LG T770, LP T770 LB T773, LV T773, LT T773, LW T773 LH T774 LS E675, LA E675, LY E675, LS T675 LS T776, LA T776, LO T776, LY T776, LB T776 LHGB T686 LT T68C, LB T68C - Hyper Mini TOPLED® LB M676 - Mini TOPLED Santana® LG M470 LS M47K, LO M47K, LY M47K Source: http://www.osram.convergy.de LUXEON: - LUMILED® LXK2-PW12-R00, LXK2-PW12-S00, LXK2-PW14-U00, LXK2-PW14-V00 LXK2-PM12-R00, LXK2-PM12-S00, LXK2-PM14-U00 LXK2-PE12-Q00, LXK2-PE12-R00, LXK2-PE12-S00, LXK2-PE14-T00, LXK2-PE14-U00 LXK2-PB12-K00, LXK2-PB12-L00, LXK2-PB12-M00, LXK2-PB14-N00, LXK2-PB14-P00, LXK2-PB14-Q00 LXK2-PR12-L00, LXK2-PR12-M00, LXK2-PR14-Q00, LXK2-PR14-R00 LXK2-PD12-Q00, LXK2-PD12-R00, LXK2-PD12-S00 LXK2-PH12-R00, LXK2-PH12-S00 LXK2-PL12-P00, LXK2-PL12-Q00, LXK2-PL12-R00 Source: www.luxeon.com KINGBRIGHT: KA-3528ASYC Source: www.kingbright.com
Q1 = Transistor:2N7002,215: MOSFET N-CH 60V 300MA SOT-23 Manufacturer's datasheet <https://assets.nexperia.com/documents/data-sheet/2N7002.pdf>; CREATED_BY: PCBLayout.com; DIGIKEY_PART_NUMBER: 1727-2764-1-ND; MANUFACTURER: Nexperia USA Inc.; MPN: 2N7002,215; PACKAGE: SOT-23-3
R11 R12 R39 R63 = rcl:R-EU_: RESISTOR, European symbol; SPICEPREFIX: R
R19 R86 R119-R126 = Resistor Array:YC164-JR-0733RL: RES ARRAY 4 RES 33 OHM 1206 Manufacturer's datasheet <https://www.yageo.com/upload/media/product/productsearch/datasheet/rchip/PYu-YC_TC_group_51_RoHS_L_9.pdf>; CREATED_BY: PCBLayout.com; DIGIKEY_PN: YC164J-33TR-ND; MANUFACTURER: Yageo; MPN: YC164-JR-0733RL; PACKAGE: 1206
R49 R77-R80 = pot:TRIM_EU-: POTENTIOMETER
R75 = Resistor Array:742C083103JP: RES ARRAY 4 RES 10K OHM 1206 Manufacturer's datasheet <https://www.ctscorp.com/wp-content/uploads/74x.pdf>; CREATED_BY: PCBLayout.com; DIGIKEY_PN: 742C083103JPTR-ND; MANUFACTURER: CTS Resistor Products; MPN: 742C083103JP; PACKAGE: 1206
S1 S2 = SparkFun-Switches:MOMENTARY-SWITCH-SPST-2: Momentary Switch (Pushbutton) - SPST - Two Circuits Normally-open (NO) SPST momentary switches (buttons, pushbuttons). Schematic symbol includes two switch circuits. Variants SMD-4.6MMX2.8MM - 4.60mm x 2.80mm Tactile Momentary Button Switch - Used on SparkFun Pro Micro - RP2040 <https://www.sparkfun.com/products/17717> SMD-5.2MM - Mini Pushbutton Switch - SMD <https://www.sparkfun.com/products/8720> - Used on Arduino Pro Mini <https://www.sparkfun.com/products/11114>; PROD_ID: SWCH-15606
T1 = ds_active:DMP3098: DUAL P-CHANNEL ENHANCEMENT MODE MOSFET
T2 = transistor-power:IRLML5203: HEXFET P-Channel Power MOSFET
TP1-TP78 TP80-TP106 = testpad:PTR1: TEST PIN
USB = SparkFun-Connectors:USB_C: USB Type C 16Pin Connector Super Speed pins not available on the 16-pin purely SMD connector so this part is best for USB 2.0 implementations. D1 and D2 are tied together enabling D+/- no matter which way the cable is plugged into the connector. The two channel configuration pins (CC1/2) are exposed. These are normally connected to ground via 5.1k resistors but can be reconfigured for high current/high power applications. **4-LAYER BOARD WARNING!!** If designing 4-layer board, make sure to select the variant _4-LAYER-ISOLATED. The linked footprint (USB-C-16-4LAYER-ISOLATED) includes some very necessary cutout polygons in the inner layers (2 and 15). This prevents the PTH mounting shield legs on the USB connector from electrically connecting any other polygons on the inner layers (usually VCC and GND).; PROD_ID: CONN-14122
X1 = ds_passive:CRYSTAL

## Net classes
1 DIFFPAIR: width 0.2 mm, drill 0.2 mm, clearance 0.1 mm